# Altium project PCB_Project.PrjPCB (part 1 of 2)
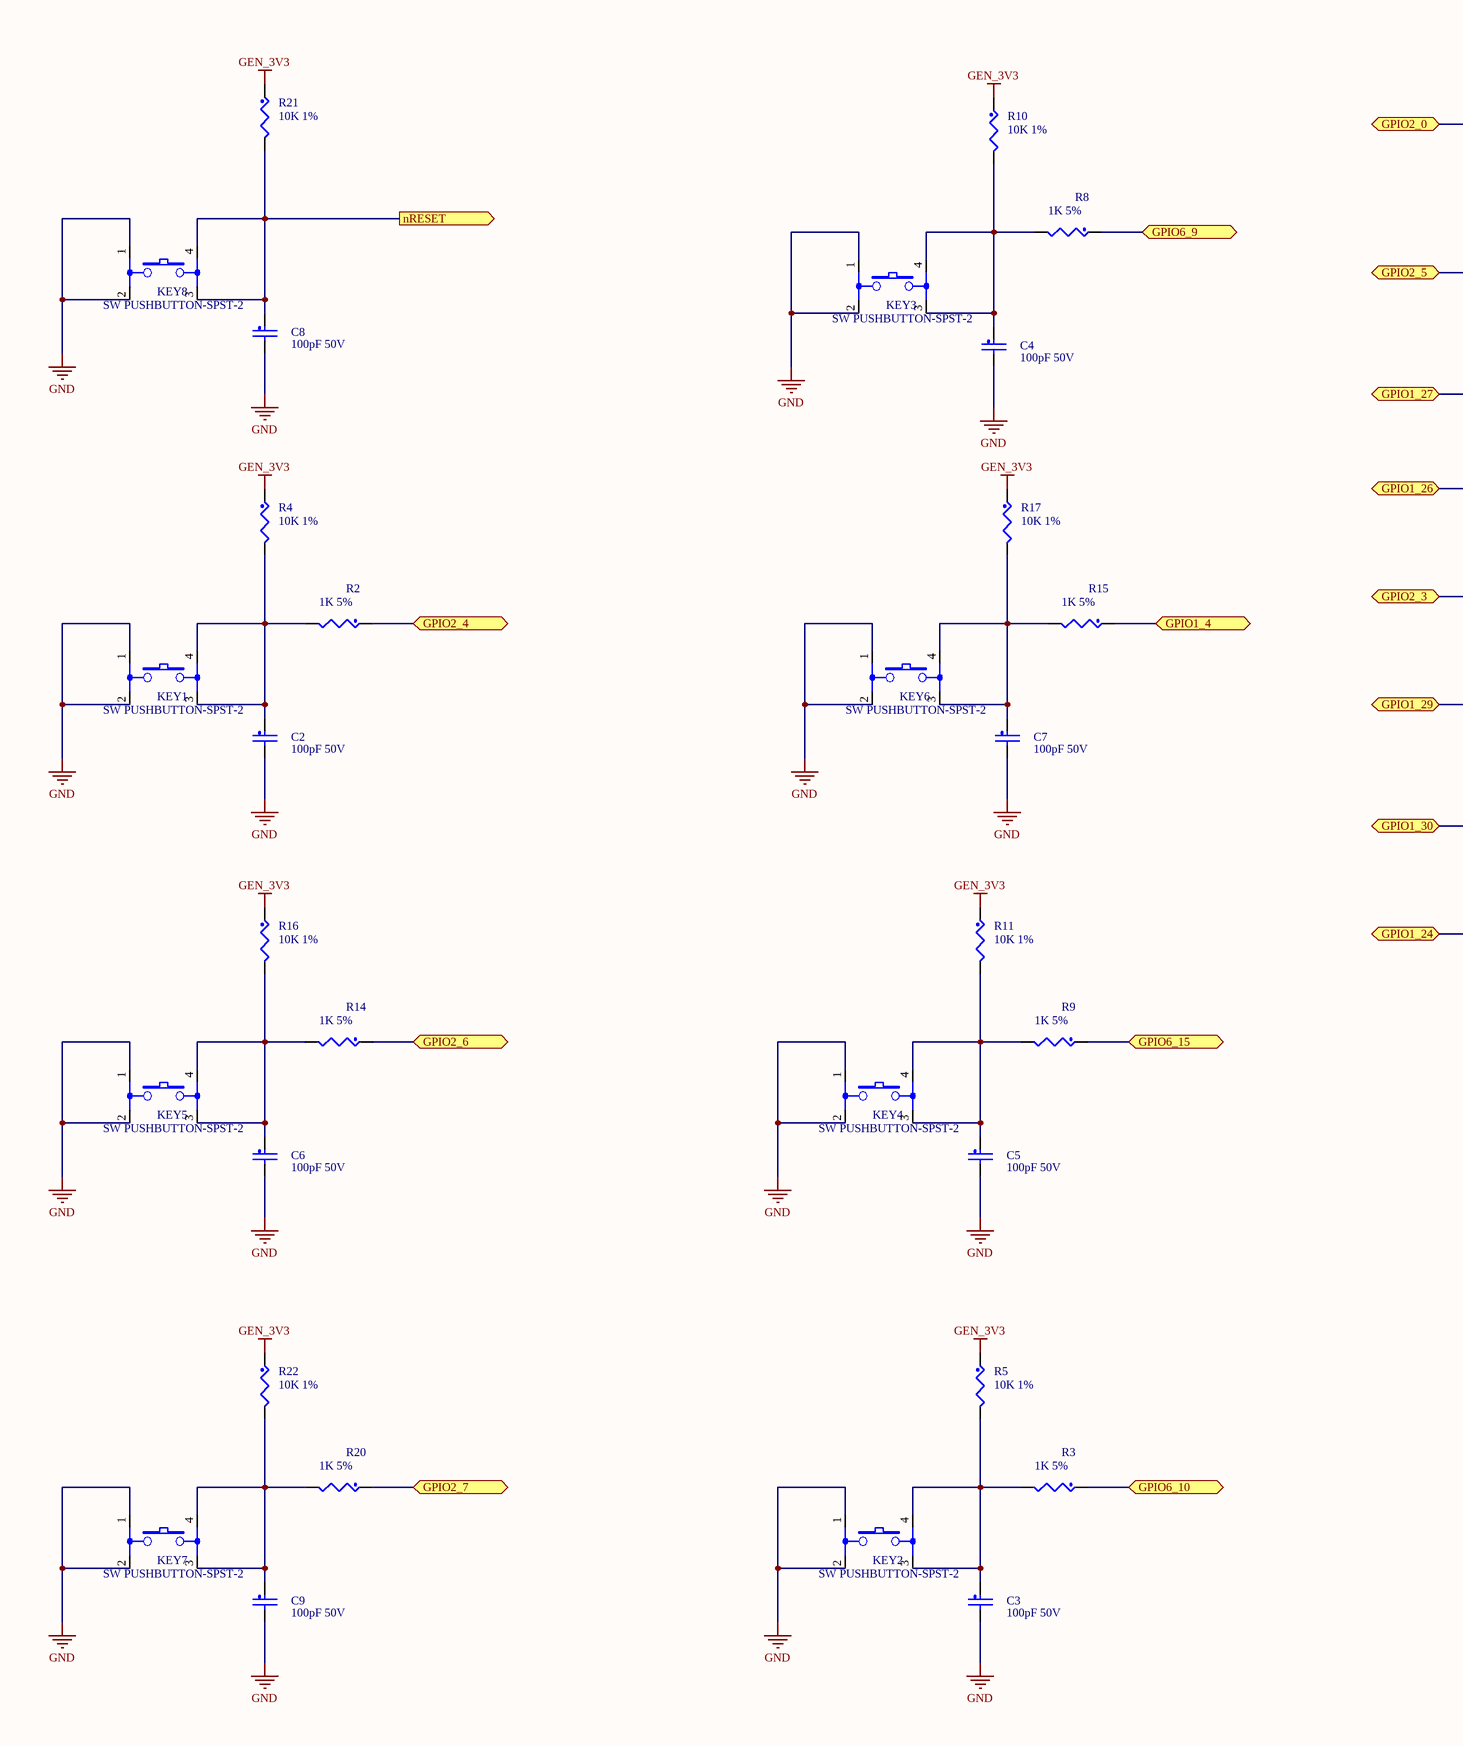
[diagram p0: Button.SchDoc, left]
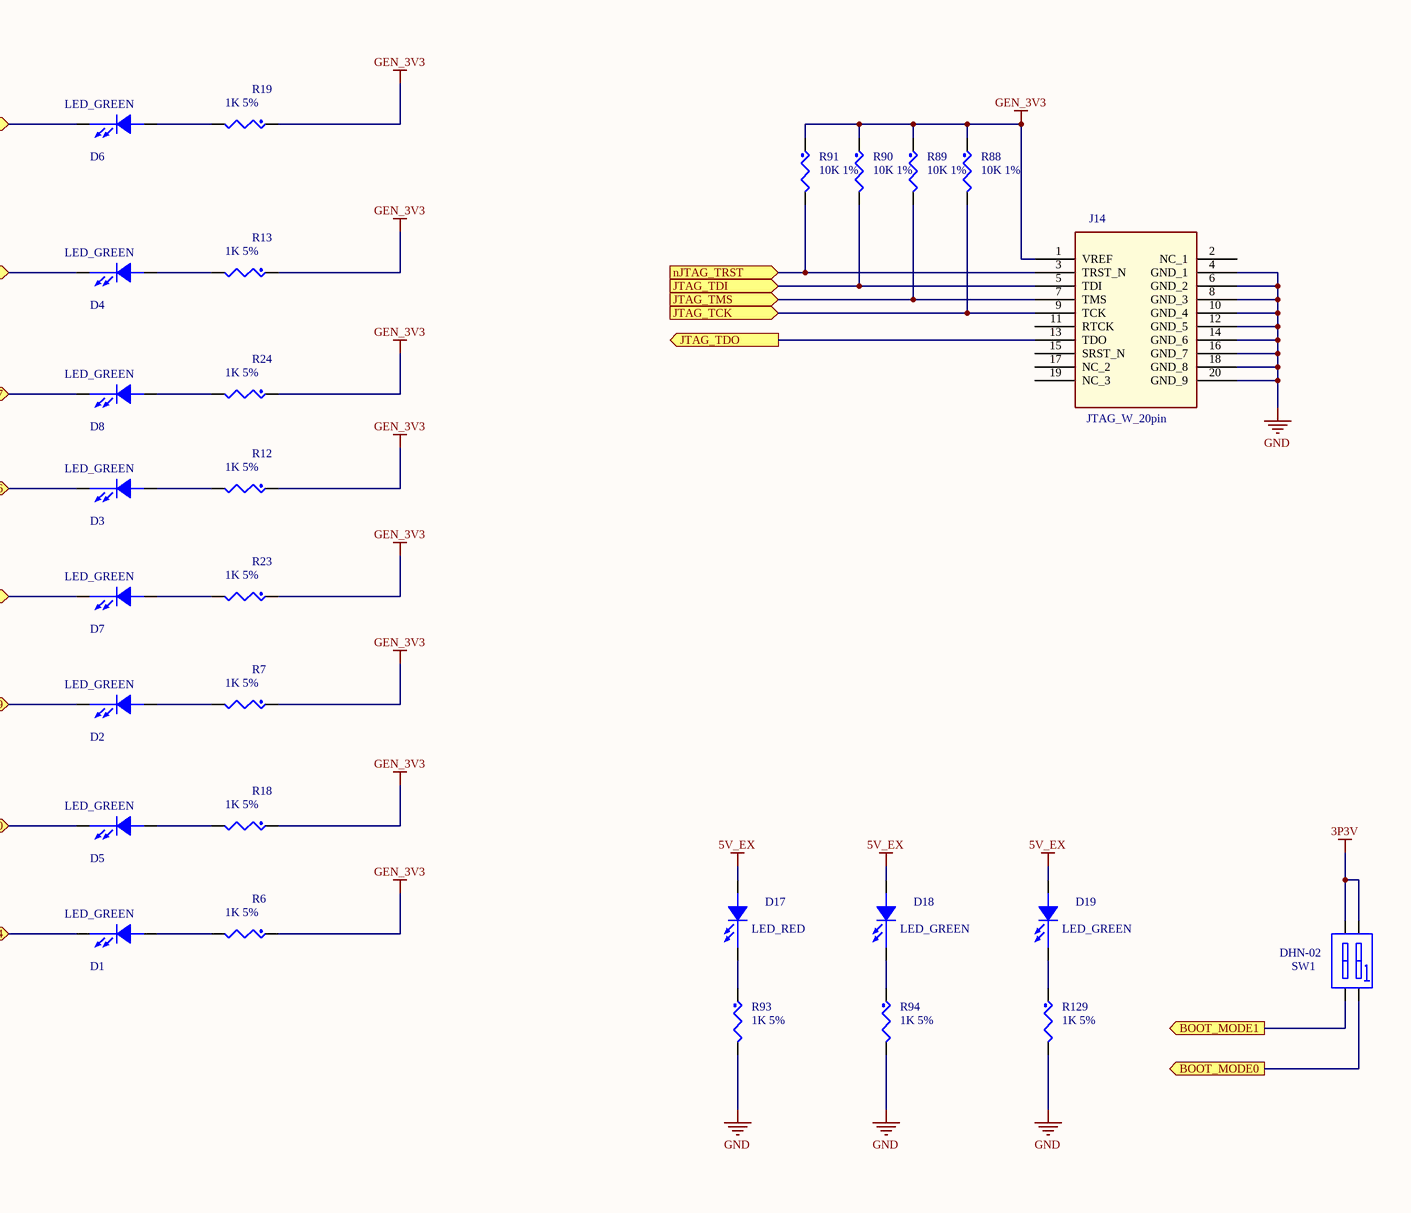
[diagram p1: Button.SchDoc, right]
10 sheets, 321 parts. Net scope: flat (ports and power ports of the same name join across sheets).
Board file: PCB1.PcbDoc
Sheets:
  Button.SchDoc
  Connector.SchDoc
  Ethernet.SchDoc
  HDMI.SchDoc
  I2C.SchDoc
  Key-RTC.SchDoc
  LVDS.SchDoc
  PWR_IN.SchDoc
  UART.SchDoc
  USB.SchDoc

## Sheet Button.SchDoc
size D

### Parts
C2  100pF 50V  [SC0603]
C3  100pF 50V  [SC0603]
C4  100pF 50V  [SC0603]
C5  100pF 50V  [SC0603]
C6  100pF 50V  [SC0603]
C7  100pF 50V  [SC0603]
C8  100pF 50V  [SC0603]
C9  100pF 50V  [SC0603]
D1  LED_GREEN  [SD0603]
D2  LED_GREEN  [SD0603]
D3  LED_GREEN  [SD0603]
D4  LED_GREEN  [SD0603]
D5  LED_GREEN  [SD0603]
D6  LED_GREEN  [SD0603]
D7  LED_GREEN  [SD0603]
D8  LED_GREEN  [SD0603]
D17  LED_RED  [SD0603]
D18  LED_GREEN  [SD0603]
D19  LED_GREEN  [SD0603]
J14  JTAG_W_20pin  [DIPMH-2-2P54X2P54-20-8-W]
KEY1  SW PUSHBUTTON-SPST-2  [SB4-6X6-5-1]
KEY2  SW PUSHBUTTON-SPST-2  [SB4-6X6-5-1]
KEY3  SW PUSHBUTTON-SPST-2  [SB4-6X6-5-1]
KEY4  SW PUSHBUTTON-SPST-2  [SB4-6X6-5-1]
KEY5  SW PUSHBUTTON-SPST-2  [SB4-6X6-5-1]
KEY6  SW PUSHBUTTON-SPST-2  [SB4-6X6-5-1]
KEY7  SW PUSHBUTTON-SPST-2  [SB4-6X6-5-1]
KEY8  SW PUSHBUTTON-SPST-2  [SB4-6X6-5-1]
R2  1K 5%  [SR0603]
R3  1K 5%  [SR0603]
R4  10K 1%  [SR0603]
R5  10K 1%  [SR0603]
R6  1K 5%  [SR0603]
R7  1K 5%  [SR0603]
R8  1K 5%  [SR0603]
R9  1K 5%  [SR0603]
R10  10K 1%  [SR0603]
R11  10K 1%  [SR0603]
R12  1K 5%  [SR0603]
R13  1K 5%  [SR0603]
R14  1K 5%  [SR0603]
R15  1K 5%  [SR0603]
R16  10K 1%  [SR0603]
R17  10K 1%  [SR0603]
R18  1K 5%  [SR0603]
R19  1K 5%  [SR0603]
R20  1K 5%  [SR0603]
R21  10K 1%  [SR0603]
R22  10K 1%  [SR0603]
R23  1K 5%  [SR0603]
R24  1K 5%  [SR0603]
R88  10K 1%  [SR0603]
R89  10K 1%  [SR0603]
R90  10K 1%  [SR0603]
R91  10K 1%  [SR0603]
R93  1K 5%  [SR0603]
R94  1K 5%  [SR0603]
R129  1K 5%  [SR0603]
SW1  DHN-02  [SW4-10X4-2-1]

### Ports
BOOT_MODE0 (out), BOOT_MODE1 (out), GPIO1_4 (bidir), GPIO1_24 (bidir), GPIO1_26 (bidir), GPIO1_27 (bidir), GPIO1_29 (bidir), GPIO1_30 (bidir), GPIO2_0 (bidir), GPIO2_3 (bidir), GPIO2_4 (bidir), GPIO2_5 (bidir), GPIO2_6 (bidir), GPIO2_7 (bidir), GPIO6_9 (bidir), GPIO6_10 (bidir), GPIO6_15 (bidir), JTAG_TCK (in), JTAG_TDI (in), JTAG_TDO (out), JTAG_TMS (in), nJTAG_TRST (in), nRESET (out)

### Nets
3P3V: SW1.1(A1) SW1.2(A2)
5V_EX: D17.1(ANODE) D18.1(ANODE) D19.1(ANODE)
GEN_3V3: J14.1(VREF) R4.1 R5.1 R6.1 R7.1 R10.1 R11.1 R12.1 R13.1 R16.1 R17.1 R18.1 R19.1 R21.1 R22.1 R23.1 R24.1 R88.1 R89.1 R90.1 R91.1
GND: C2.2 C3.2 C4.2 C5.2 C6.2 C7.2 C8.2 C9.2 J14.4(GND_1) J14.6(GND_2) J14.8(GND_3) J14.10(GND_4) J14.12(GND_5) J14.14(GND_6) J14.16(GND_7) J14.18(GND_8) J14.20(GND_9) KEY1.1 KEY1.2 KEY2.1 KEY2.2 KEY3.1 KEY3.2 KEY4.1 KEY4.2 KEY5.1 KEY5.2 KEY6.1 KEY6.2 KEY7.1 KEY7.2 KEY8.1 KEY8.2 R93.2 R94.2 R129.2
NetC2_1: C2.1 KEY1.3 KEY1.4 R2.2 R4.2
NetC3_1: C3.1 KEY2.3 KEY2.4 R3.2 R5.2
NetC4_1: C4.1 KEY3.3 KEY3.4 R8.2 R10.2
NetC5_1: C5.1 KEY4.3 KEY4.4 R9.2 R11.2
NetC6_1: C6.1 KEY5.3 KEY5.4 R14.2 R16.2
NetC7_1: C7.1 KEY6.3 KEY6.4 R15.2 R17.2
NetC8_1: C8.1 KEY8.3 KEY8.4 R21.2 ; port nRESET
NetC9_1: C9.1 KEY7.3 KEY7.4 R20.2 R22.2
NetD1_1: D1.1(ANODE) R6.2
NetD1_2: D1.2(CATHODE) ; port GPIO1_24
NetD2_1: D2.1(ANODE) R7.2
NetD2_2: D2.2(CATHODE) ; port GPIO1_29
NetD3_1: D3.1(ANODE) R12.2
NetD3_2: D3.2(CATHODE) ; port GPIO1_26
NetD4_1: D4.1(ANODE) R13.2
NetD4_2: D4.2(CATHODE) ; port GPIO2_5
NetD5_1: D5.1(ANODE) R18.2
NetD5_2: D5.2(CATHODE) ; port GPIO1_30
NetD6_1: D6.1(ANODE) R19.2
NetD6_2: D6.2(CATHODE) ; port GPIO2_0
NetD7_1: D7.1(ANODE) R23.2
NetD7_2: D7.2(CATHODE) ; port GPIO2_3
NetD8_1: D8.1(ANODE) R24.2
NetD8_2: D8.2(CATHODE) ; port GPIO1_27
NetD17_2: D17.2(CATHODE) R93.1
NetD18_2: D18.2(CATHODE) R94.1
NetD19_2: D19.2(CATHODE) R129.1
NetJ14_3: J14.3(TRST_N) R91.2 ; port nJTAG_TRST
NetJ14_5: J14.5(TDI) R90.2 ; port JTAG_TDI
NetJ14_7: J14.7(TMS) R89.2 ; port JTAG_TMS
NetJ14_9: J14.9(TCK) R88.2 ; port JTAG_TCK
NetJ14_13: J14.13(TDO) ; port JTAG_TDO
NetMXM314-92p2x9p6-0p5-socket_WH_P143: R15.1 ; port GPIO1_4
NetMXM314-92p2x9p6-0p5-socket_WH_S92: SW1.3(B2) ; port BOOT_MODE1
NetMXM314-92p2x9p6-0p5-socket_WH_S93: SW1.4(B1) ; port BOOT_MODE0
NetMXM314-92p2x9p6-0p5-socket_WH_S95: R2.1 ; port GPIO2_4
NetMXM314-92p2x9p6-0p5-socket_WH_S99: R8.1 ; port GPIO6_9
NetMXM314-92p2x9p6-0p5-socket_WH_S100: R14.1 ; port GPIO2_6
NetMXM314-92p2x9p6-0p5-socket_WH_S102: R20.1 ; port GPIO2_7
NetMXM314-92p2x9p6-0p5-socket_WH_S108: R3.1 ; port GPIO6_10
NetMXM314-92p2x9p6-0p5-socket_WH_S109: R9.1 ; port GPIO6_15

Not connected (* = marked no-connect by the designer): J14 2(NC_1) 11(RTCK) 15(SRST_N) 17(NC_2) 19(NC_3)

### Library data of the parts
C2-C9 = CAP_NP: CLASS: DISCRETE
D1-D8 D17-D19 = LED
J14 = JTAG_20pin
R2-R24 R88-R91 R93 R94 R129 = RES: CLASS: DISCRETE
SW1 = SW DIP-2_0

## Sheet Connector.SchDoc
size D
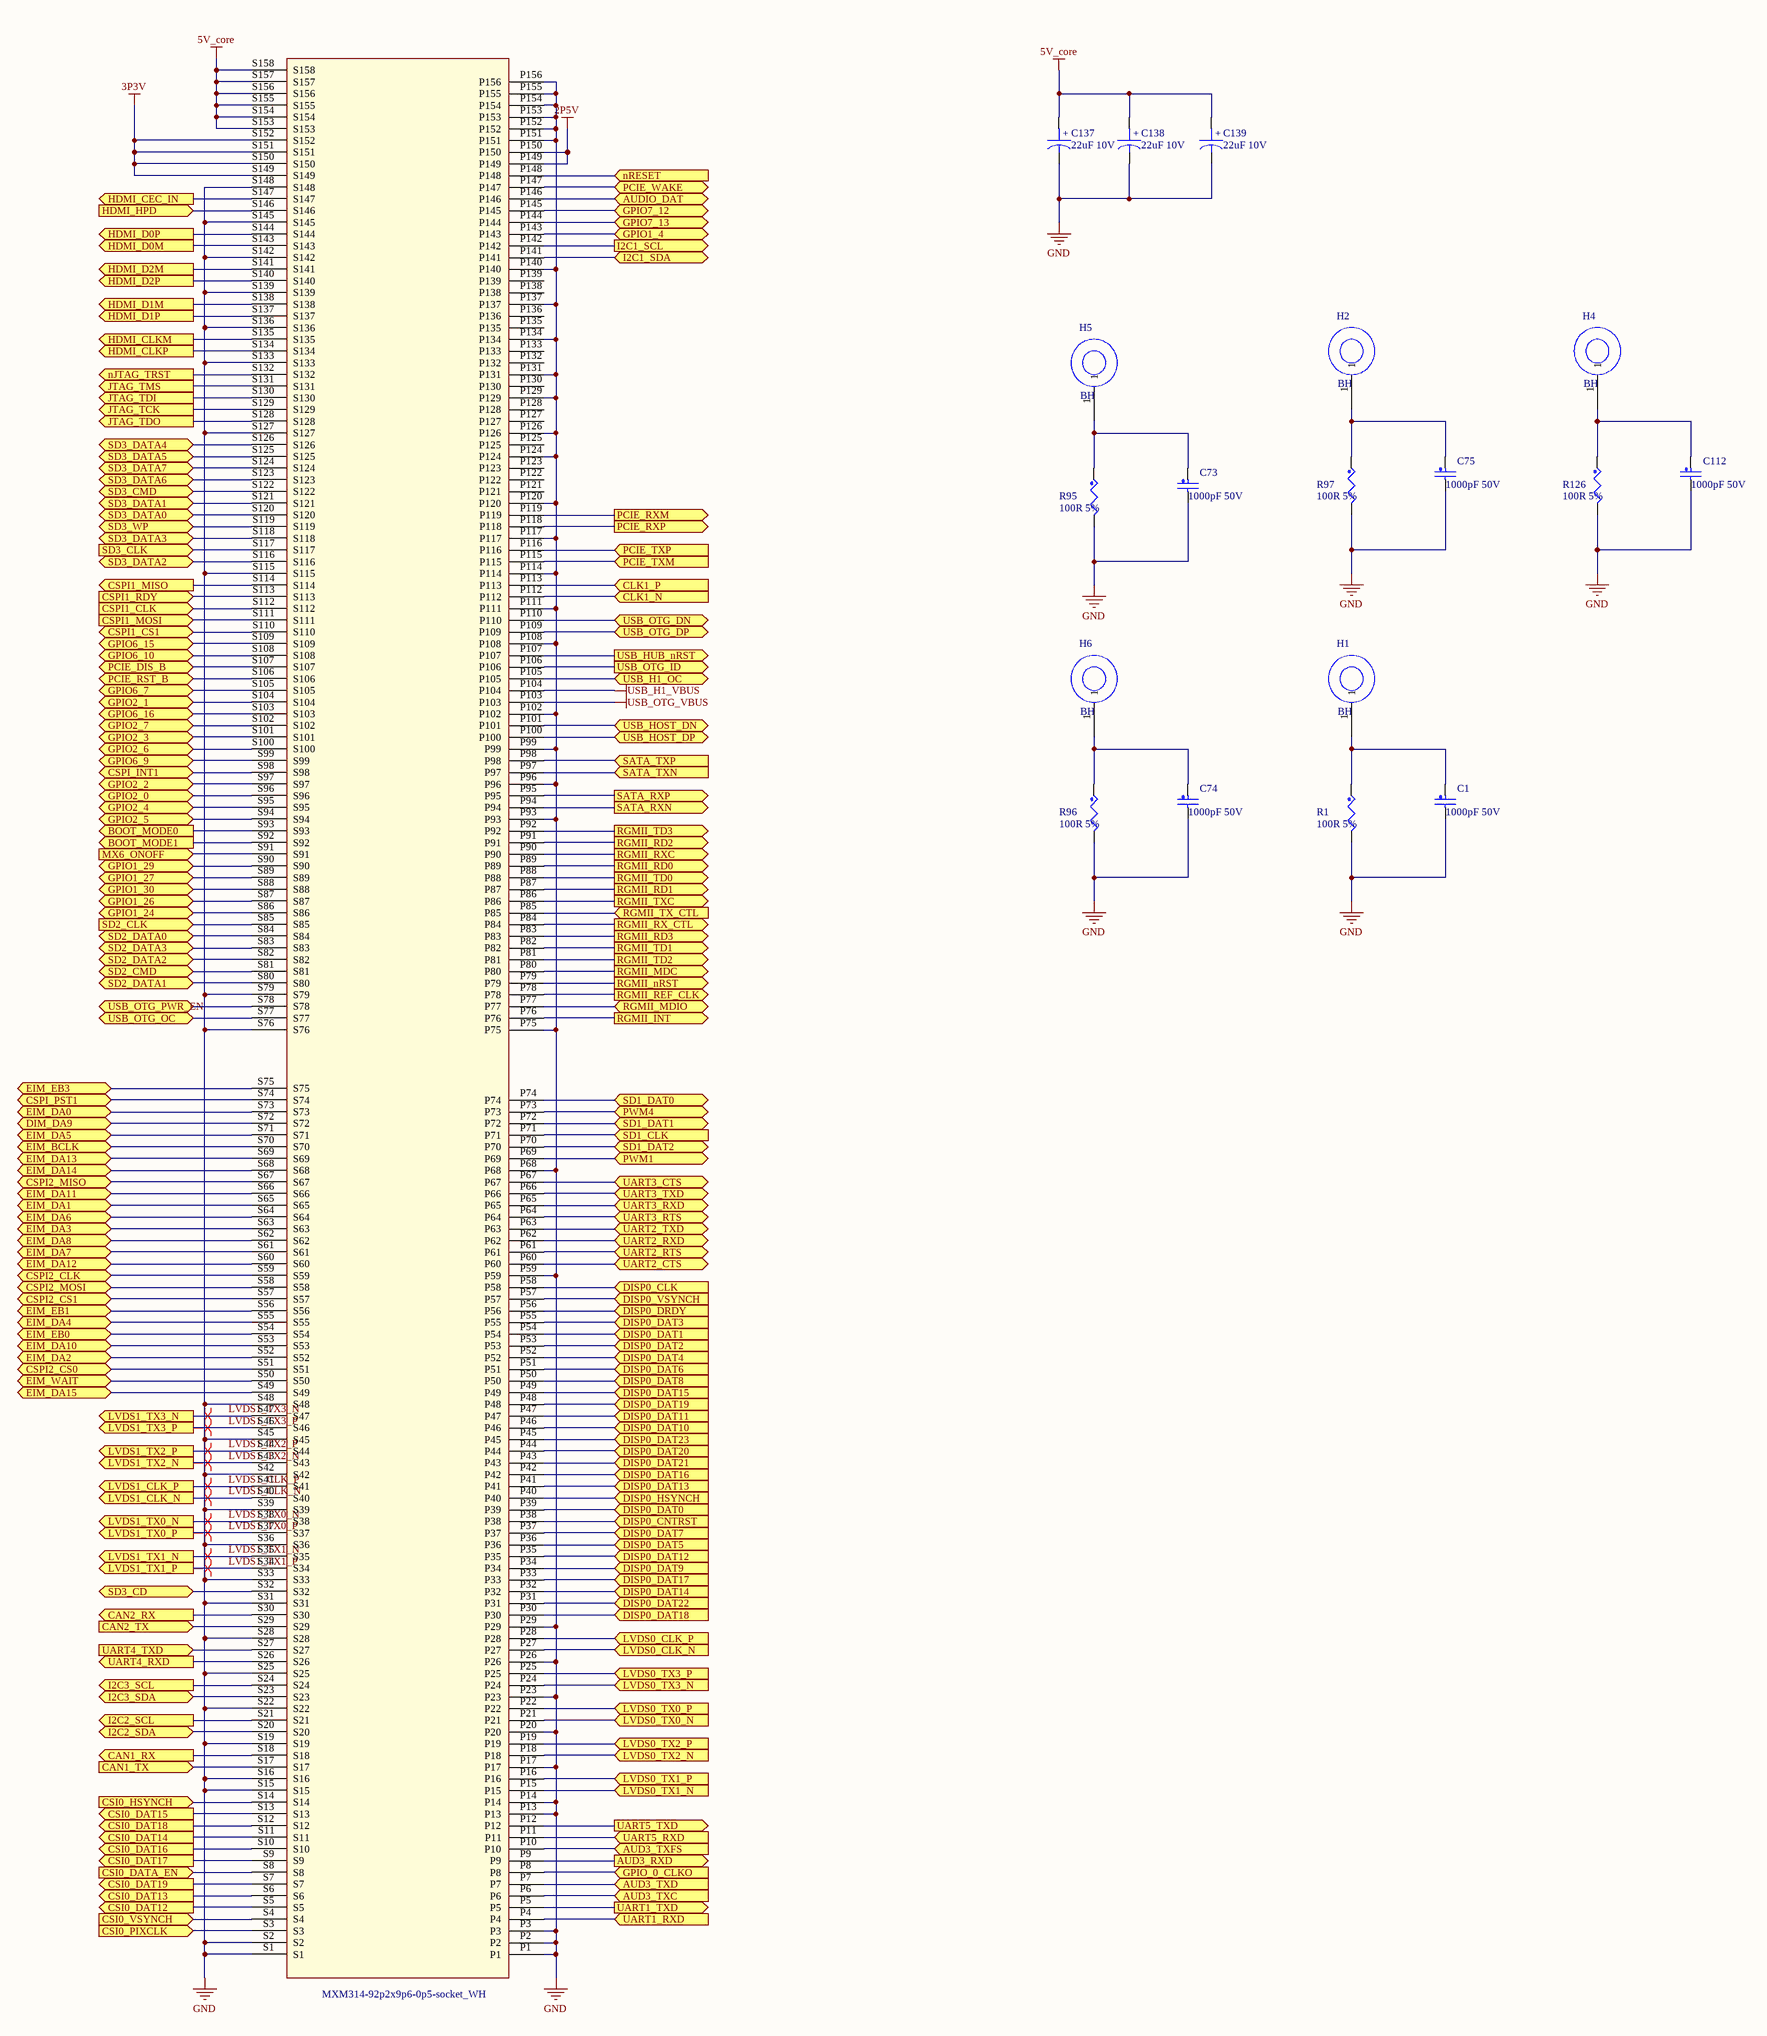
[diagram p2: Connector.SchDoc]

### Parts
C1  1000pF 50V  [SC0603]
C73  1000pF 50V  [SC0603]
C74  1000pF 50V  [SC0603]
C75  1000pF 50V  [SC0603]
C112  1000pF 50V  [SC0603]
C137  22uF 10V  [SC0805]
C138  22uF 10V  [SC0805]
C139  22uF 10V  [SC0805]
H1  BH  [H30]
H2  BH  [H30]
H4  BH  [H30]
H5  BH  [H30]
H6  BH  [H30]
MXM314-92p2x9p6-0p5-socket_WH  MXM314-92p2x9p6-0p5-socket_WH  [MXM314-92P2X9P6-0P5-SOCKET_WH]  (value not drawn)
R1  100R 5%  [SR0603]
R95  100R 5%  [SR0603]
R96  100R 5%  [SR0603]
R97  100R 5%  [SR0603]
R126  100R 5%  [SR0603]

### Ports
AUD3_RXD (out), AUD3_TXC (in), AUD3_TXD (in), AUD3_TXFS (in), AUDIO_DAT (bidir), BOOT_MODE0 (out), BOOT_MODE1 (out), CAN1_RX (out), CAN1_TX (in), CAN2_RX (out), CAN2_TX (in), CLK1_N (in), CLK1_P (in), CSI0_DAT12 (out), CSI0_DAT13 (out), CSI0_DAT14 (out), CSI0_DAT15 (out), CSI0_DAT16 (out), CSI0_DAT17 (out), CSI0_DAT18 (out), CSI0_DAT19 (out), CSI0_DATA_EN (in), CSI0_HSYNCH (in), CSI0_PIXCLK (in), CSI0_VSYNCH (in), CSPI1_CLK (in), CSPI1_CS1 (bidir), CSPI1_MISO (out), CSPI1_MOSI (in), CSPI1_RDY (in), CSPI2_CLK (bidir), CSPI2_CS0 (bidir), CSPI2_CS1 (bidir), CSPI2_MISO (bidir), CSPI2_MOSI (bidir), CSPI_INT1 (bidir), CSPI_PST1 (bidir), DIM_DA9 (bidir), DISP0_CLK (in), DISP0_CNTRST (in), DISP0_DAT0 (in), DISP0_DAT1 (in), DISP0_DAT2 (in), DISP0_DAT3 (in), DISP0_DAT4 (in), DISP0_DAT5 (in), DISP0_DAT6 (in), DISP0_DAT7 (in), DISP0_DAT8 (in), DISP0_DAT9 (in), DISP0_DAT10 (in), DISP0_DAT11 (in), DISP0_DAT12 (in), DISP0_DAT13 (in), DISP0_DAT14 (in), DISP0_DAT15 (in), DISP0_DAT16 (in), DISP0_DAT17 (in), DISP0_DAT18 (in), DISP0_DAT19 (in), DISP0_DAT20 (in), DISP0_DAT21 (in), DISP0_DAT22 (in), DISP0_DAT23 (in), DISP0_DRDY (in), DISP0_HSYNCH (in), DISP0_VSYNCH (in), EIM_BCLK (bidir), EIM_DA0 (bidir), EIM_DA1 (bidir), EIM_DA2 (bidir), EIM_DA3 (bidir), EIM_DA4 (bidir), EIM_DA5 (bidir), EIM_DA6 (bidir), EIM_DA7 (bidir), EIM_DA8 (bidir), EIM_DA10 (bidir), EIM_DA11 (bidir), EIM_DA12 (bidir), EIM_DA13 (bidir), EIM_DA14 (bidir), EIM_DA15 (bidir), EIM_EB0 (bidir), EIM_EB1 (bidir), EIM_EB3 (bidir), EIM_WAIT (bidir), GPIO1_4 (bidir), GPIO1_24 (bidir), GPIO1_26 (bidir), GPIO1_27 (bidir), GPIO1_29 (bidir), GPIO1_30 (bidir), GPIO2_0 (bidir), GPIO2_1 (bidir), GPIO2_2 (bidir), GPIO2_3 (bidir), GPIO2_4 (bidir), GPIO2_5 (bidir), GPIO2_6 (bidir), GPIO2_7 (bidir), GPIO6_7 (bidir), GPIO6_9 (bidir), GPIO6_10 (bidir), GPIO6_15 (bidir), GPIO6_16 (bidir), GPIO7_12 (bidir), GPIO7_13 (bidir), GPIO_0_CLKO (in), HDMI_CEC_IN (out), HDMI_CLKM (out), HDMI_CLKP (out), HDMI_D0M (out), HDMI_D0P (out), HDMI_D1M (out), HDMI_D1P (out), HDMI_D2M (out), HDMI_D2P (out), HDMI_HPD (in), I2C1_SCL (out), I2C1_SDA (bidir), I2C2_SCL (out), I2C2_SDA (bidir), I2C3_SCL (out), I2C3_SDA (bidir), JTAG_TCK (out), JTAG_TDI (out), JTAG_TDO (out), JTAG_TMS (out), LVDS0_CLK_N (in), LVDS0_CLK_P (in), LVDS0_TX0_N (in), LVDS0_TX0_P (in), LVDS0_TX1_N (in), LVDS0_TX1_P (in), LVDS0_TX2_N (in), LVDS0_TX2_P (in), LVDS0_TX3_N (in), LVDS0_TX3_P (in), LVDS1_CLK_N (out), LVDS1_CLK_P (out), LVDS1_TX0_N (out), LVDS1_TX0_P (out), LVDS1_TX1_N (out), LVDS1_TX1_P (out), LVDS1_TX2_N (out), LVDS1_TX2_P (out), LVDS1_TX3_N (out), LVDS1_TX3_P (out), MX6_ONOFF (in), nJTAG_TRST (out), nRESET (in), PCIE_DIS_B (bidir), PCIE_RST_B (bidir), PCIE_RXM (out), PCIE_RXP (out), PCIE_TXM (in), PCIE_TXP (in), PCIE_WAKE (bidir), PWM1 (bidir), PWM4 (bidir), RGMII_INT (out), RGMII_MDC (out), RGMII_MDIO (bidir), RGMII_nRST (out), RGMII_RD0 (out), RGMII_RD1 (out), RGMII_RD2 (out), RGMII_RD3 (out), RGMII_REF_CLK (out), RGMII_RX_CTL (out), RGMII_RXC (out), RGMII_TD0 (out), RGMII_TD1 (out), RGMII_TD2 (out), RGMII_TD3 (out), RGMII_TX_CTL (in), RGMII_TXC (out), SATA_RXN (out), SATA_RXP (out), SATA_TXN (in), SATA_TXP (in), SD1_CLK (in), SD1_DAT0 (bidir), SD1_DAT1 (bidir), SD1_DAT2 (bidir), SD2_CLK (in), SD2_CMD (bidir), SD2_DATA0 (bidir), SD2_DATA1 (bidir), SD2_DATA2 (bidir), SD2_DATA3 (bidir), SD3_CD (bidir), SD3_CLK (in), SD3_CMD (bidir), SD3_DATA0 (bidir), SD3_DATA1 (bidir), SD3_DATA2 (bidir), SD3_DATA3 (bidir), SD3_DATA4 (bidir), SD3_DATA5 (bidir), SD3_DATA6 (bidir), SD3_DATA7 (bidir), SD3_WP (bidir), UART1_RXD (in), UART1_TXD (out), UART2_CTS (bidir), UART2_RTS (bidir), UART2_RXD (bidir), UART2_TXD (bidir), UART3_CTS (bidir), UART3_RTS (bidir), UART3_RXD (bidir), UART3_TXD (bidir), UART4_RXD (out), UART4_TXD (in), UART5_RXD (in), UART5_TXD (out), USB_H1_OC (bidir), USB_HOST_DN (bidir), USB_HOST_DP (bidir), USB_HUB_nRST (out), USB_OTG_DN (bidir), USB_OTG_DP (bidir), USB_OTG_ID (out), USB_OTG_OC (bidir), USB_OTG_PWR_EN (bidir)

### Nets
2P5V: MXM314-92p2x9p6-0p5-socket_WH.P149 MXM314-92p2x9p6-0p5-socket_WH.P150
3P3V: MXM314-92p2x9p6-0p5-socket_WH.S149 MXM314-92p2x9p6-0p5-socket_WH.S150 MXM314-92p2x9p6-0p5-socket_WH.S151 MXM314-92p2x9p6-0p5-socket_WH.S152
5V_core: C137.1 C138.1 C139.1 MXM314-92p2x9p6-0p5-socket_WH.S153 MXM314-92p2x9p6-0p5-socket_WH.S154 MXM314-92p2x9p6-0p5-socket_WH.S155 MXM314-92p2x9p6-0p5-socket_WH.S156 MXM314-92p2x9p6-0p5-socket_WH.S157 MXM314-92p2x9p6-0p5-socket_WH.S158
GND: C1.2 C73.2 C74.2 C75.2 C112.2 C137.2 C138.2 C139.2 MXM314-92p2x9p6-0p5-socket_WH.P1 MXM314-92p2x9p6-0p5-socket_WH.P2 MXM314-92p2x9p6-0p5-socket_WH.P3 MXM314-92p2x9p6-0p5-socket_WH.P13 MXM314-92p2x9p6-0p5-socket_WH.P14 MXM314-92p2x9p6-0p5-socket_WH.P17 MXM314-92p2x9p6-0p5-socket_WH.P20 MXM314-92p2x9p6-0p5-socket_WH.P23 MXM314-92p2x9p6-0p5-socket_WH.P26 MXM314-92p2x9p6-0p5-socket_WH.P29 MXM314-92p2x9p6-0p5-socket_WH.P59 MXM314-92p2x9p6-0p5-socket_WH.P68 MXM314-92p2x9p6-0p5-socket_WH.P75 MXM314-92p2x9p6-0p5-socket_WH.P93 MXM314-92p2x9p6-0p5-socket_WH.P96 MXM314-92p2x9p6-0p5-socket_WH.P99 MXM314-92p2x9p6-0p5-socket_WH.P102 MXM314-92p2x9p6-0p5-socket_WH.P108 MXM314-92p2x9p6-0p5-socket_WH.P111 MXM314-92p2x9p6-0p5-socket_WH.P114 MXM314-92p2x9p6-0p5-socket_WH.P117 MXM314-92p2x9p6-0p5-socket_WH.P120 MXM314-92p2x9p6-0p5-socket_WH.P124 MXM314-92p2x9p6-0p5-socket_WH.P126 MXM314-92p2x9p6-0p5-socket_WH.P129 MXM314-92p2x9p6-0p5-socket_WH.P131 MXM314-92p2x9p6-0p5-socket_WH.P134 MXM314-92p2x9p6-0p5-socket_WH.P137 MXM314-92p2x9p6-0p5-socket_WH.P140 MXM314-92p2x9p6-0p5-socket_WH.P151 MXM314-92p2x9p6-0p5-socket_WH.P152 MXM314-92p2x9p6-0p5-socket_WH.P153 MXM314-92p2x9p6-0p5-socket_WH.P154 MXM314-92p2x9p6-0p5-socket_WH.P155 MXM314-92p2x9p6-0p5-socket_WH.P156 MXM314-92p2x9p6-0p5-socket_WH.S1 MXM314-92p2x9p6-0p5-socket_WH.S2 MXM314-92p2x9p6-0p5-socket_WH.S15 MXM314-92p2x9p6-0p5-socket_WH.S16 MXM314-92p2x9p6-0p5-socket_WH.S19 MXM314-92p2x9p6-0p5-socket_WH.S22 MXM314-92p2x9p6-0p5-socket_WH.S25 MXM314-92p2x9p6-0p5-socket_WH.S28 MXM314-92p2x9p6-0p5-socket_WH.S31 MXM314-92p2x9p6-0p5-socket_WH.S33 MXM314-92p2x9p6-0p5-socket_WH.S36 MXM314-92p2x9p6-0p5-socket_WH.S39 MXM314-92p2x9p6-0p5-socket_WH.S42 MXM314-92p2x9p6-0p5-socket_WH.S45 MXM314-92p2x9p6-0p5-socket_WH.S48 MXM314-92p2x9p6-0p5-socket_WH.S76 MXM314-92p2x9p6-0p5-socket_WH.S79 MXM314-92p2x9p6-0p5-socket_WH.S115 MXM314-92p2x9p6-0p5-socket_WH.S127 MXM314-92p2x9p6-0p5-socket_WH.S133 MXM314-92p2x9p6-0p5-socket_WH.S136 MXM314-92p2x9p6-0p5-socket_WH.S139 MXM314-92p2x9p6-0p5-socket_WH.S142 MXM314-92p2x9p6-0p5-socket_WH.S145 MXM314-92p2x9p6-0p5-socket_WH.S148 R1.2 R95.2 R96.2 R97.2 R126.2
USB_H1_VBUS: MXM314-92p2x9p6-0p5-socket_WH.P104
USB_OTG_VBUS: MXM314-92p2x9p6-0p5-socket_WH.P103
HDMI_CLK_N: MXM314-92p2x9p6-0p5-socket_WH.S135 ; port HDMI_CLKM
HDMI_CLK_P: MXM314-92p2x9p6-0p5-socket_WH.S134 ; port HDMI_CLKP
HDMI_D0_N: MXM314-92p2x9p6-0p5-socket_WH.S143 ; port HDMI_D0M
HDMI_D0_P: MXM314-92p2x9p6-0p5-socket_WH.S144 ; port HDMI_D0P
HDMI_D1_N: MXM314-92p2x9p6-0p5-socket_WH.S138 ; port HDMI_D1M
HDMI_D1_P: MXM314-92p2x9p6-0p5-socket_WH.S137 ; port HDMI_D1P
HDMI_D2_N: MXM314-92p2x9p6-0p5-socket_WH.S141 ; port HDMI_D2M
HDMI_D2_P: MXM314-92p2x9p6-0p5-socket_WH.S140 ; port HDMI_D2P
LVDS1_CLK_N: MXM314-92p2x9p6-0p5-socket_WH.S40 ; port LVDS1_CLK_N
LVDS1_CLK_P: MXM314-92p2x9p6-0p5-socket_WH.S41 ; port LVDS1_CLK_P
LVDS1_TX0_N: MXM314-92p2x9p6-0p5-socket_WH.S38 ; port LVDS1_TX0_N
LVDS1_TX0_P: MXM314-92p2x9p6-0p5-socket_WH.S37 ; port LVDS1_TX0_P
LVDS1_TX1_N: MXM314-92p2x9p6-0p5-socket_WH.S35 ; port LVDS1_TX1_N
LVDS1_TX1_P: MXM314-92p2x9p6-0p5-socket_WH.S34 ; port LVDS1_TX1_P
LVDS1_TX2_N: MXM314-92p2x9p6-0p5-socket_WH.S43 ; port LVDS1_TX2_N
LVDS1_TX2_P: MXM314-92p2x9p6-0p5-socket_WH.S44 ; port LVDS1_TX2_P
LVDS1_TX3_N: MXM314-92p2x9p6-0p5-socket_WH.S47 ; port LVDS1_TX3_N
LVDS1_TX3_P: MXM314-92p2x9p6-0p5-socket_WH.S46 ; port LVDS1_TX3_P
USB_HOST_D_N: MXM314-92p2x9p6-0p5-socket_WH.P101 ; port USB_HOST_DN
USB_HOST_D_P: MXM314-92p2x9p6-0p5-socket_WH.P100 ; port USB_HOST_DP
USB_OTG_D_N: MXM314-92p2x9p6-0p5-socket_WH.P110 ; port USB_OTG_DN
USB_OTG_D_P: MXM314-92p2x9p6-0p5-socket_WH.P109 ; port USB_OTG_DP
NetC1_1: C1.1 H1.1 R1.1
NetC8_1: MXM314-92p2x9p6-0p5-socket_WH.P148 ; port nRESET
NetC51_1: MXM314-92p2x9p6-0p5-socket_WH.P79 ; port RGMII_nRST
NetC68_1: MXM314-92p2x9p6-0p5-socket_WH.S146 ; port HDMI_HPD
NetC73_1: C73.1 H5.1 R95.1
NetC74_1: C74.1 H6.1 R96.1
NetC75_1: C75.1 H2.1 R97.1
NetC87_1: MXM314-92p2x9p6-0p5-socket_WH.P144 ; port GPIO7_13
NetC112_1: C112.1 H4.1 R126.1
NetC132_2: MXM314-92p2x9p6-0p5-socket_WH.P107 ; port USB_HUB_nRST
NetD1_2: MXM314-92p2x9p6-0p5-socket_WH.S86 ; port GPIO1_24
NetD2_2: MXM314-92p2x9p6-0p5-socket_WH.S90 ; port GPIO1_29
NetD3_2: MXM314-92p2x9p6-0p5-socket_WH.S87 ; port GPIO1_26
NetD4_2: MXM314-92p2x9p6-0p5-socket_WH.S94 ; port GPIO2_5
NetD5_2: MXM314-92p2x9p6-0p5-socket_WH.S88 ; port GPIO1_30
NetD6_2: MXM314-92p2x9p6-0p5-socket_WH.S96 ; port GPIO2_0
NetD7_2: MXM314-92p2x9p6-0p5-socket_WH.S101 ; port GPIO2_3
NetD8_2: MXM314-92p2x9p6-0p5-socket_WH.S89 ; port GPIO1_27
NetJ11_16: MXM314-92p2x9p6-0p5-socket_WH.S104 ; port GPIO2_1
NetJ11_17: MXM314-92p2x9p6-0p5-socket_WH.S105 ; port GPIO6_7
NetJ11_19: MXM314-92p2x9p6-0p5-socket_WH.P69 ; port PWM1
NetJ12_4: MXM314-92p2x9p6-0p5-socket_WH.P106 ; port USB_OTG_ID
NetJ14_3: MXM314-92p2x9p6-0p5-socket_WH.S132 ; port nJTAG_TRST
NetJ14_5: MXM314-92p2x9p6-0p5-socket_WH.S130 ; port JTAG_TDI
NetJ14_7: MXM314-92p2x9p6-0p5-socket_WH.S131 ; port JTAG_TMS
NetJ14_9: MXM314-92p2x9p6-0p5-socket_WH.S129 ; port JTAG_TCK
NetJ14_13: MXM314-92p2x9p6-0p5-socket_WH.S128 ; port JTAG_TDO
NetMXM314-92p2x9p6-0p5-socket_WH_P4: MXM314-92p2x9p6-0p5-socket_WH.P4 ; port UART1_RXD
NetMXM314-92p2x9p6-0p5-socket_WH_P5: MXM314-92p2x9p6-0p5-socket_WH.P5 ; port UART1_TXD
NetMXM314-92p2x9p6-0p5-socket_WH_P6: MXM314-92p2x9p6-0p5-socket_WH.P6 ; port AUD3_TXC
NetMXM314-92p2x9p6-0p5-socket_WH_P7: MXM314-92p2x9p6-0p5-socket_WH.P7 ; port AUD3_TXD
NetMXM314-92p2x9p6-0p5-socket_WH_P8: MXM314-92p2x9p6-0p5-socket_WH.P8 ; port GPIO_0_CLKO
NetMXM314-92p2x9p6-0p5-socket_WH_P9: MXM314-92p2x9p6-0p5-socket_WH.P9 ; port AUD3_RXD
NetMXM314-92p2x9p6-0p5-socket_WH_P10: MXM314-92p2x9p6-0p5-socket_WH.P10 ; port AUD3_TXFS
NetMXM314-92p2x9p6-0p5-socket_WH_P11: MXM314-92p2x9p6-0p5-socket_WH.P11 ; port UART5_RXD
NetMXM314-92p2x9p6-0p5-socket_WH_P12: MXM314-92p2x9p6-0p5-socket_WH.P12 ; port UART5_TXD
NetMXM314-92p2x9p6-0p5-socket_WH_P15: MXM314-92p2x9p6-0p5-socket_WH.P15 ; port LVDS0_TX1_N
NetMXM314-92p2x9p6-0p5-socket_WH_P16: MXM314-92p2x9p6-0p5-socket_WH.P16 ; port LVDS0_TX1_P
NetMXM314-92p2x9p6-0p5-socket_WH_P18: MXM314-92p2x9p6-0p5-socket_WH.P18 ; port LVDS0_TX2_N
NetMXM314-92p2x9p6-0p5-socket_WH_P19: MXM314-92p2x9p6-0p5-socket_WH.P19 ; port LVDS0_TX2_P
NetMXM314-92p2x9p6-0p5-socket_WH_P21: MXM314-92p2x9p6-0p5-socket_WH.P21 ; port LVDS0_TX0_N
NetMXM314-92p2x9p6-0p5-socket_WH_P22: MXM314-92p2x9p6-0p5-socket_WH.P22 ; port LVDS0_TX0_P
NetMXM314-92p2x9p6-0p5-socket_WH_P24: MXM314-92p2x9p6-0p5-socket_WH.P24 ; port LVDS0_TX3_N
NetMXM314-92p2x9p6-0p5-socket_WH_P25: MXM314-92p2x9p6-0p5-socket_WH.P25 ; port LVDS0_TX3_P
NetMXM314-92p2x9p6-0p5-socket_WH_P27: MXM314-92p2x9p6-0p5-socket_WH.P27 ; port LVDS0_CLK_N
NetMXM314-92p2x9p6-0p5-socket_WH_P28: MXM314-92p2x9p6-0p5-socket_WH.P28 ; port LVDS0_CLK_P
NetMXM314-92p2x9p6-0p5-socket_WH_P30: MXM314-92p2x9p6-0p5-socket_WH.P30 ; port DISP0_DAT18
NetMXM314-92p2x9p6-0p5-socket_WH_P31: MXM314-92p2x9p6-0p5-socket_WH.P31 ; port DISP0_DAT22
NetMXM314-92p2x9p6-0p5-socket_WH_P32: MXM314-92p2x9p6-0p5-socket_WH.P32 ; port DISP0_DAT14
NetMXM314-92p2x9p6-0p5-socket_WH_P33: MXM314-92p2x9p6-0p5-socket_WH.P33 ; port DISP0_DAT17
NetMXM314-92p2x9p6-0p5-socket_WH_P34: MXM314-92p2x9p6-0p5-socket_WH.P34 ; port DISP0_DAT9
NetMXM314-92p2x9p6-0p5-socket_WH_P35: MXM314-92p2x9p6-0p5-socket_WH.P35 ; port DISP0_DAT12
NetMXM314-92p2x9p6-0p5-socket_WH_P36: MXM314-92p2x9p6-0p5-socket_WH.P36 ; port DISP0_DAT5
NetMXM314-92p2x9p6-0p5-socket_WH_P37: MXM314-92p2x9p6-0p5-socket_WH.P37 ; port DISP0_DAT7
NetMXM314-92p2x9p6-0p5-socket_WH_P38: MXM314-92p2x9p6-0p5-socket_WH.P38 ; port DISP0_CNTRST
NetMXM314-92p2x9p6-0p5-socket_WH_P39: MXM314-92p2x9p6-0p5-socket_WH.P39 ; port DISP0_DAT0
NetMXM314-92p2x9p6-0p5-socket_WH_P40: MXM314-92p2x9p6-0p5-socket_WH.P40 ; port DISP0_HSYNCH
NetMXM314-92p2x9p6-0p5-socket_WH_P41: MXM314-92p2x9p6-0p5-socket_WH.P41 ; port DISP0_DAT13
NetMXM314-92p2x9p6-0p5-socket_WH_P42: MXM314-92p2x9p6-0p5-socket_WH.P42 ; port DISP0_DAT16
NetMXM314-92p2x9p6-0p5-socket_WH_P43: MXM314-92p2x9p6-0p5-socket_WH.P43 ; port DISP0_DAT21
NetMXM314-92p2x9p6-0p5-socket_WH_P44: MXM314-92p2x9p6-0p5-socket_WH.P44 ; port DISP0_DAT20
NetMXM314-92p2x9p6-0p5-socket_WH_P45: MXM314-92p2x9p6-0p5-socket_WH.P45 ; port DISP0_DAT23
NetMXM314-92p2x9p6-0p5-socket_WH_P46: MXM314-92p2x9p6-0p5-socket_WH.P46 ; port DISP0_DAT10
NetMXM314-92p2x9p6-0p5-socket_WH_P47: MXM314-92p2x9p6-0p5-socket_WH.P47 ; port DISP0_DAT11
NetMXM314-92p2x9p6-0p5-socket_WH_P48: MXM314-92p2x9p6-0p5-socket_WH.P48 ; port DISP0_DAT19
NetMXM314-92p2x9p6-0p5-socket_WH_P49: MXM314-92p2x9p6-0p5-socket_WH.P49 ; port DISP0_DAT15
NetMXM314-92p2x9p6-0p5-socket_WH_P50: MXM314-92p2x9p6-0p5-socket_WH.P50 ; port DISP0_DAT8
NetMXM314-92p2x9p6-0p5-socket_WH_P51: MXM314-92p2x9p6-0p5-socket_WH.P51 ; port DISP0_DAT6
NetMXM314-92p2x9p6-0p5-socket_WH_P52: MXM314-92p2x9p6-0p5-socket_WH.P52 ; port DISP0_DAT4
NetMXM314-92p2x9p6-0p5-socket_WH_P53: MXM314-92p2x9p6-0p5-socket_WH.P53 ; port DISP0_DAT2
NetMXM314-92p2x9p6-0p5-socket_WH_P54: MXM314-92p2x9p6-0p5-socket_WH.P54 ; port DISP0_DAT1
NetMXM314-92p2x9p6-0p5-socket_WH_P55: MXM314-92p2x9p6-0p5-socket_WH.P55 ; port DISP0_DAT3
NetMXM314-92p2x9p6-0p5-socket_WH_P56: MXM314-92p2x9p6-0p5-socket_WH.P56 ; port DISP0_DRDY
NetMXM314-92p2x9p6-0p5-socket_WH_P57: MXM314-92p2x9p6-0p5-socket_WH.P57 ; port DISP0_VSYNCH
NetMXM314-92p2x9p6-0p5-socket_WH_P58: MXM314-92p2x9p6-0p5-socket_WH.P58 ; port DISP0_CLK
NetMXM314-92p2x9p6-0p5-socket_WH_P60: MXM314-92p2x9p6-0p5-socket_WH.P60 ; port UART2_CTS
NetMXM314-92p2x9p6-0p5-socket_WH_P61: MXM314-92p2x9p6-0p5-socket_WH.P61 ; port UART2_RTS
NetMXM314-92p2x9p6-0p5-socket_WH_P62: MXM314-92p2x9p6-0p5-socket_WH.P62 ; port UART2_RXD
NetMXM314-92p2x9p6-0p5-socket_WH_P63: MXM314-92p2x9p6-0p5-socket_WH.P63 ; port UART2_TXD
NetMXM314-92p2x9p6-0p5-socket_WH_P64: MXM314-92p2x9p6-0p5-socket_WH.P64 ; port UART3_RTS
NetMXM314-92p2x9p6-0p5-socket_WH_P65: MXM314-92p2x9p6-0p5-socket_WH.P65 ; port UART3_RXD
NetMXM314-92p2x9p6-0p5-socket_WH_P66: MXM314-92p2x9p6-0p5-socket_WH.P66 ; port UART3_TXD
NetMXM314-92p2x9p6-0p5-socket_WH_P67: MXM314-92p2x9p6-0p5-socket_WH.P67 ; port UART3_CTS
NetMXM314-92p2x9p6-0p5-socket_WH_P70: MXM314-92p2x9p6-0p5-socket_WH.P70 ; port SD1_DAT2
NetMXM314-92p2x9p6-0p5-socket_WH_P71: MXM314-92p2x9p6-0p5-socket_WH.P71 ; port SD1_CLK
NetMXM314-92p2x9p6-0p5-socket_WH_P72: MXM314-92p2x9p6-0p5-socket_WH.P72 ; port SD1_DAT1
NetMXM314-92p2x9p6-0p5-socket_WH_P73: MXM314-92p2x9p6-0p5-socket_WH.P73 ; port PWM4
NetMXM314-92p2x9p6-0p5-socket_WH_P74: MXM314-92p2x9p6-0p5-socket_WH.P74 ; port SD1_DAT0
NetMXM314-92p2x9p6-0p5-socket_WH_P76: MXM314-92p2x9p6-0p5-socket_WH.P76 ; port RGMII_INT
NetMXM314-92p2x9p6-0p5-socket_WH_P77: MXM314-92p2x9p6-0p5-socket_WH.P77 ; port RGMII_MDIO
NetMXM314-92p2x9p6-0p5-socket_WH_P78: MXM314-92p2x9p6-0p5-socket_WH.P78 ; port RGMII_REF_CLK
NetMXM314-92p2x9p6-0p5-socket_WH_P80: MXM314-92p2x9p6-0p5-socket_WH.P80 ; port RGMII_MDC
NetMXM314-92p2x9p6-0p5-socket_WH_P81: MXM314-92p2x9p6-0p5-socket_WH.P81 ; port RGMII_TD2
NetMXM314-92p2x9p6-0p5-socket_WH_P82: MXM314-92p2x9p6-0p5-socket_WH.P82 ; port RGMII_TD1
NetMXM314-92p2x9p6-0p5-socket_WH_P83: MXM314-92p2x9p6-0p5-socket_WH.P83 ; port RGMII_RD3
NetMXM314-92p2x9p6-0p5-socket_WH_P84: MXM314-92p2x9p6-0p5-socket_WH.P84 ; port RGMII_RX_CTL
NetMXM314-92p2x9p6-0p5-socket_WH_P85: MXM314-92p2x9p6-0p5-socket_WH.P85 ; port RGMII_TX_CTL
NetMXM314-92p2x9p6-0p5-socket_WH_P86: MXM314-92p2x9p6-0p5-socket_WH.P86 ; port RGMII_TXC
NetMXM314-92p2x9p6-0p5-socket_WH_P87: MXM314-92p2x9p6-0p5-socket_WH.P87 ; port RGMII_RD1
NetMXM314-92p2x9p6-0p5-socket_WH_P88: MXM314-92p2x9p6-0p5-socket_WH.P88 ; port RGMII_TD0
NetMXM314-92p2x9p6-0p5-socket_WH_P89: MXM314-92p2x9p6-0p5-socket_WH.P89 ; port RGMII_RD0
NetMXM314-92p2x9p6-0p5-socket_WH_P90: MXM314-92p2x9p6-0p5-socket_WH.P90 ; port RGMII_RXC
NetMXM314-92p2x9p6-0p5-socket_WH_P91: MXM314-92p2x9p6-0p5-socket_WH.P91 ; port RGMII_RD2
NetMXM314-92p2x9p6-0p5-socket_WH_P92: MXM314-92p2x9p6-0p5-socket_WH.P92 ; port RGMII_TD3
NetMXM314-92p2x9p6-0p5-socket_WH_P94: MXM314-92p2x9p6-0p5-socket_WH.P94 ; port SATA_RXN
NetMXM314-92p2x9p6-0p5-socket_WH_P95: MXM314-92p2x9p6-0p5-socket_WH.P95 ; port SATA_RXP
NetMXM314-92p2x9p6-0p5-socket_WH_P97: MXM314-92p2x9p6-0p5-socket_WH.P97 ; port SATA_TXN
NetMXM314-92p2x9p6-0p5-socket_WH_P98: MXM314-92p2x9p6-0p5-socket_WH.P98 ; port SATA_TXP
NetMXM314-92p2x9p6-0p5-socket_WH_P105: MXM314-92p2x9p6-0p5-socket_WH.P105 ; port USB_H1_OC
NetMXM314-92p2x9p6-0p5-socket_WH_P112: MXM314-92p2x9p6-0p5-socket_WH.P112 ; port CLK1_N
NetMXM314-92p2x9p6-0p5-socket_WH_P113: MXM314-92p2x9p6-0p5-socket_WH.P113 ; port CLK1_P
NetMXM314-92p2x9p6-0p5-socket_WH_P115: MXM314-92p2x9p6-0p5-socket_WH.P115 ; port PCIE_TXM
NetMXM314-92p2x9p6-0p5-socket_WH_P116: MXM314-92p2x9p6-0p5-socket_WH.P116 ; port PCIE_TXP
NetMXM314-92p2x9p6-0p5-socket_WH_P118: MXM314-92p2x9p6-0p5-socket_WH.P118 ; port PCIE_RXP
NetMXM314-92p2x9p6-0p5-socket_WH_P119: MXM314-92p2x9p6-0p5-socket_WH.P119 ; port PCIE_RXM
NetMXM314-92p2x9p6-0p5-socket_WH_P141: MXM314-92p2x9p6-0p5-socket_WH.P141 ; port I2C1_SDA
NetMXM314-92p2x9p6-0p5-socket_WH_P142: MXM314-92p2x9p6-0p5-socket_WH.P142 ; port I2C1_SCL
NetMXM314-92p2x9p6-0p5-socket_WH_P143: MXM314-92p2x9p6-0p5-socket_WH.P143 ; port GPIO1_4
NetMXM314-92p2x9p6-0p5-socket_WH_P145: MXM314-92p2x9p6-0p5-socket_WH.P145 ; port GPIO7_12
NetMXM314-92p2x9p6-0p5-socket_WH_P146: MXM314-92p2x9p6-0p5-socket_WH.P146 ; port AUDIO_DAT
NetMXM314-92p2x9p6-0p5-socket_WH_P147: MXM314-92p2x9p6-0p5-socket_WH.P147 ; port PCIE_WAKE
NetMXM314-92p2x9p6-0p5-socket_WH_S3: MXM314-92p2x9p6-0p5-socket_WH.S3 ; port CSI0_PIXCLK
NetMXM314-92p2x9p6-0p5-socket_WH_S4: MXM314-92p2x9p6-0p5-socket_WH.S4 ; port CSI0_VSYNCH
NetMXM314-92p2x9p6-0p5-socket_WH_S5: MXM314-92p2x9p6-0p5-socket_WH.S5 ; port CSI0_DAT12
NetMXM314-92p2x9p6-0p5-socket_WH_S6: MXM314-92p2x9p6-0p5-socket_WH.S6 ; port CSI0_DAT13
NetMXM314-92p2x9p6-0p5-socket_WH_S7: MXM314-92p2x9p6-0p5-socket_WH.S7 ; port CSI0_DAT19
NetMXM314-92p2x9p6-0p5-socket_WH_S8: MXM314-92p2x9p6-0p5-socket_WH.S8 ; port CSI0_DATA_EN
NetMXM314-92p2x9p6-0p5-socket_WH_S9: MXM314-92p2x9p6-0p5-socket_WH.S9 ; port CSI0_DAT17
NetMXM314-92p2x9p6-0p5-socket_WH_S10: MXM314-92p2x9p6-0p5-socket_WH.S10 ; port CSI0_DAT16
NetMXM314-92p2x9p6-0p5-socket_WH_S11: MXM314-92p2x9p6-0p5-socket_WH.S11 ; port CSI0_DAT14
NetMXM314-92p2x9p6-0p5-socket_WH_S12: MXM314-92p2x9p6-0p5-socket_WH.S12 ; port CSI0_DAT18
NetMXM314-92p2x9p6-0p5-socket_WH_S13: MXM314-92p2x9p6-0p5-socket_WH.S13 ; port CSI0_DAT15
NetMXM314-92p2x9p6-0p5-socket_WH_S14: MXM314-92p2x9p6-0p5-socket_WH.S14 ; port CSI0_HSYNCH
NetMXM314-92p2x9p6-0p5-socket_WH_S17: MXM314-92p2x9p6-0p5-socket_WH.S17 ; port CAN1_TX
NetMXM314-92p2x9p6-0p5-socket_WH_S18: MXM314-92p2x9p6-0p5-socket_WH.S18 ; port CAN1_RX
NetMXM314-92p2x9p6-0p5-socket_WH_S20: MXM314-92p2x9p6-0p5-socket_WH.S20 ; port I2C2_SDA
NetMXM314-92p2x9p6-0p5-socket_WH_S21: MXM314-92p2x9p6-0p5-socket_WH.S21 ; port I2C2_SCL
NetMXM314-92p2x9p6-0p5-socket_WH_S23: MXM314-92p2x9p6-0p5-socket_WH.S23 ; port I2C3_SDA
NetMXM314-92p2x9p6-0p5-socket_WH_S24: MXM314-92p2x9p6-0p5-socket_WH.S24 ; port I2C3_SCL
NetMXM314-92p2x9p6-0p5-socket_WH_S26: MXM314-92p2x9p6-0p5-socket_WH.S26 ; port UART4_RXD
NetMXM314-92p2x9p6-0p5-socket_WH_S27: MXM314-92p2x9p6-0p5-socket_WH.S27 ; port UART4_TXD
NetMXM314-92p2x9p6-0p5-socket_WH_S29: MXM314-92p2x9p6-0p5-socket_WH.S29 ; port CAN2_TX
NetMXM314-92p2x9p6-0p5-socket_WH_S30: MXM314-92p2x9p6-0p5-socket_WH.S30 ; port CAN2_RX
NetMXM314-92p2x9p6-0p5-socket_WH_S32: MXM314-92p2x9p6-0p5-socket_WH.S32 ; port SD3_CD
NetMXM314-92p2x9p6-0p5-socket_WH_S49: MXM314-92p2x9p6-0p5-socket_WH.S49 ; port EIM_DA15
NetMXM314-92p2x9p6-0p5-socket_WH_S50: MXM314-92p2x9p6-0p5-socket_WH.S50 ; port EIM_WAIT
NetMXM314-92p2x9p6-0p5-socket_WH_S51: MXM314-92p2x9p6-0p5-socket_WH.S51 ; port CSPI2_CS0
NetMXM314-92p2x9p6-0p5-socket_WH_S52: MXM314-92p2x9p6-0p5-socket_WH.S52 ; port EIM_DA2
NetMXM314-92p2x9p6-0p5-socket_WH_S53: MXM314-92p2x9p6-0p5-socket_WH.S53 ; port EIM_DA10
NetMXM314-92p2x9p6-0p5-socket_WH_S54: MXM314-92p2x9p6-0p5-socket_WH.S54 ; port EIM_EB0
NetMXM314-92p2x9p6-0p5-socket_WH_S55: MXM314-92p2x9p6-0p5-socket_WH.S55 ; port EIM_DA4
NetMXM314-92p2x9p6-0p5-socket_WH_S56: MXM314-92p2x9p6-0p5-socket_WH.S56 ; port EIM_EB1
NetMXM314-92p2x9p6-0p5-socket_WH_S57: MXM314-92p2x9p6-0p5-socket_WH.S57 ; port CSPI2_CS1
NetMXM314-92p2x9p6-0p5-socket_WH_S58: MXM314-92p2x9p6-0p5-socket_WH.S58 ; port CSPI2_MOSI
NetMXM314-92p2x9p6-0p5-socket_WH_S59: MXM314-92p2x9p6-0p5-socket_WH.S59 ; port CSPI2_CLK
NetMXM314-92p2x9p6-0p5-socket_WH_S60: MXM314-92p2x9p6-0p5-socket_WH.S60 ; port EIM_DA12
NetMXM314-92p2x9p6-0p5-socket_WH_S61: MXM314-92p2x9p6-0p5-socket_WH.S61 ; port EIM_DA7
NetMXM314-92p2x9p6-0p5-socket_WH_S62: MXM314-92p2x9p6-0p5-socket_WH.S62 ; port EIM_DA8
NetMXM314-92p2x9p6-0p5-socket_WH_S63: MXM314-92p2x9p6-0p5-socket_WH.S63 ; port EIM_DA3
NetMXM314-92p2x9p6-0p5-socket_WH_S64: MXM314-92p2x9p6-0p5-socket_WH.S64 ; port EIM_DA6
NetMXM314-92p2x9p6-0p5-socket_WH_S65: MXM314-92p2x9p6-0p5-socket_WH.S65 ; port EIM_DA1
NetMXM314-92p2x9p6-0p5-socket_WH_S66: MXM314-92p2x9p6-0p5-socket_WH.S66 ; port EIM_DA11
NetMXM314-92p2x9p6-0p5-socket_WH_S67: MXM314-92p2x9p6-0p5-socket_WH.S67 ; port CSPI2_MISO
NetMXM314-92p2x9p6-0p5-socket_WH_S68: MXM314-92p2x9p6-0p5-socket_WH.S68 ; port EIM_DA14
NetMXM314-92p2x9p6-0p5-socket_WH_S69: MXM314-92p2x9p6-0p5-socket_WH.S69 ; port EIM_DA13
NetMXM314-92p2x9p6-0p5-socket_WH_S70: MXM314-92p2x9p6-0p5-socket_WH.S70 ; port EIM_BCLK
NetMXM314-92p2x9p6-0p5-socket_WH_S71: MXM314-92p2x9p6-0p5-socket_WH.S71 ; port EIM_DA5
NetMXM314-92p2x9p6-0p5-socket_WH_S72: MXM314-92p2x9p6-0p5-socket_WH.S72 ; port DIM_DA9
NetMXM314-92p2x9p6-0p5-socket_WH_S73: MXM314-92p2x9p6-0p5-socket_WH.S73 ; port EIM_DA0
NetMXM314-92p2x9p6-0p5-socket_WH_S74: MXM314-92p2x9p6-0p5-socket_WH.S74 ; port CSPI_PST1
NetMXM314-92p2x9p6-0p5-socket_WH_S75: MXM314-92p2x9p6-0p5-socket_WH.S75 ; port EIM_EB3
NetMXM314-92p2x9p6-0p5-socket_WH_S77: MXM314-92p2x9p6-0p5-socket_WH.S77 ; port USB_OTG_OC
NetMXM314-92p2x9p6-0p5-socket_WH_S78: MXM314-92p2x9p6-0p5-socket_WH.S78 ; port USB_OTG_PWR_EN
NetMXM314-92p2x9p6-0p5-socket_WH_S80: MXM314-92p2x9p6-0p5-socket_WH.S80 ; port SD2_DATA1
NetMXM314-92p2x9p6-0p5-socket_WH_S81: MXM314-92p2x9p6-0p5-socket_WH.S81 ; port SD2_CMD
NetMXM314-92p2x9p6-0p5-socket_WH_S82: MXM314-92p2x9p6-0p5-socket_WH.S82 ; port SD2_DATA2
NetMXM314-92p2x9p6-0p5-socket_WH_S83: MXM314-92p2x9p6-0p5-socket_WH.S83 ; port SD2_DATA3
NetMXM314-92p2x9p6-0p5-socket_WH_S84: MXM314-92p2x9p6-0p5-socket_WH.S84 ; port SD2_DATA0
NetMXM314-92p2x9p6-0p5-socket_WH_S85: MXM314-92p2x9p6-0p5-socket_WH.S85 ; port SD2_CLK
NetMXM314-92p2x9p6-0p5-socket_WH_S91: MXM314-92p2x9p6-0p5-socket_WH.S91 ; port MX6_ONOFF
NetMXM314-92p2x9p6-0p5-socket_WH_S92: MXM314-92p2x9p6-0p5-socket_WH.S92 ; port BOOT_MODE1
NetMXM314-92p2x9p6-0p5-socket_WH_S93: MXM314-92p2x9p6-0p5-socket_WH.S93 ; port BOOT_MODE0
NetMXM314-92p2x9p6-0p5-socket_WH_S95: MXM314-92p2x9p6-0p5-socket_WH.S95 ; port GPIO2_4
NetMXM314-92p2x9p6-0p5-socket_WH_S97: MXM314-92p2x9p6-0p5-socket_WH.S97 ; port GPIO2_2
NetMXM314-92p2x9p6-0p5-socket_WH_S98: MXM314-92p2x9p6-0p5-socket_WH.S98 ; port CSPI_INT1
NetMXM314-92p2x9p6-0p5-socket_WH_S99: MXM314-92p2x9p6-0p5-socket_WH.S99 ; port GPIO6_9
NetMXM314-92p2x9p6-0p5-socket_WH_S100: MXM314-92p2x9p6-0p5-socket_WH.S100 ; port GPIO2_6
NetMXM314-92p2x9p6-0p5-socket_WH_S102: MXM314-92p2x9p6-0p5-socket_WH.S102 ; port GPIO2_7
NetMXM314-92p2x9p6-0p5-socket_WH_S103: MXM314-92p2x9p6-0p5-socket_WH.S103 ; port GPIO6_16
NetMXM314-92p2x9p6-0p5-socket_WH_S106: MXM314-92p2x9p6-0p5-socket_WH.S106 ; port PCIE_RST_B
NetMXM314-92p2x9p6-0p5-socket_WH_S107: MXM314-92p2x9p6-0p5-socket_WH.S107 ; port PCIE_DIS_B
NetMXM314-92p2x9p6-0p5-socket_WH_S108: MXM314-92p2x9p6-0p5-socket_WH.S108 ; port GPIO6_10
NetMXM314-92p2x9p6-0p5-socket_WH_S109: MXM314-92p2x9p6-0p5-socket_WH.S109 ; port GPIO6_15
NetMXM314-92p2x9p6-0p5-socket_WH_S110: MXM314-92p2x9p6-0p5-socket_WH.S110 ; port CSPI1_CS1
NetMXM314-92p2x9p6-0p5-socket_WH_S111: MXM314-92p2x9p6-0p5-socket_WH.S111 ; port CSPI1_MOSI
NetMXM314-92p2x9p6-0p5-socket_WH_S112: MXM314-92p2x9p6-0p5-socket_WH.S112 ; port CSPI1_CLK
NetMXM314-92p2x9p6-0p5-socket_WH_S113: MXM314-92p2x9p6-0p5-socket_WH.S113 ; port CSPI1_RDY
NetMXM314-92p2x9p6-0p5-socket_WH_S114: MXM314-92p2x9p6-0p5-socket_WH.S114 ; port CSPI1_MISO
NetMXM314-92p2x9p6-0p5-socket_WH_S116: MXM314-92p2x9p6-0p5-socket_WH.S116 ; port SD3_DATA2
NetMXM314-92p2x9p6-0p5-socket_WH_S117: MXM314-92p2x9p6-0p5-socket_WH.S117 ; port SD3_CLK
NetMXM314-92p2x9p6-0p5-socket_WH_S118: MXM314-92p2x9p6-0p5-socket_WH.S118 ; port SD3_DATA3
NetMXM314-92p2x9p6-0p5-socket_WH_S119: MXM314-92p2x9p6-0p5-socket_WH.S119 ; port SD3_WP
NetMXM314-92p2x9p6-0p5-socket_WH_S120: MXM314-92p2x9p6-0p5-socket_WH.S120 ; port SD3_DATA0
NetMXM314-92p2x9p6-0p5-socket_WH_S121: MXM314-92p2x9p6-0p5-socket_WH.S121 ; port SD3_DATA1
NetMXM314-92p2x9p6-0p5-socket_WH_S122: MXM314-92p2x9p6-0p5-socket_WH.S122 ; port SD3_CMD
NetMXM314-92p2x9p6-0p5-socket_WH_S123: MXM314-92p2x9p6-0p5-socket_WH.S123 ; port SD3_DATA6
NetMXM314-92p2x9p6-0p5-socket_WH_S124: MXM314-92p2x9p6-0p5-socket_WH.S124 ; port SD3_DATA7
NetMXM314-92p2x9p6-0p5-socket_WH_S125: MXM314-92p2x9p6-0p5-socket_WH.S125 ; port SD3_DATA5
NetMXM314-92p2x9p6-0p5-socket_WH_S126: MXM314-92p2x9p6-0p5-socket_WH.S126 ; port SD3_DATA4
NetMXM314-92p2x9p6-0p5-socket_WH_S147: MXM314-92p2x9p6-0p5-socket_WH.S147 ; port HDMI_CEC_IN

Not connected (* = marked no-connect by the designer): MXM314-92p2x9p6-0p5-socket_WH P121 P122 P123 P125 P127 P128 P130 P132 P133 P135 P136 P138 P139

### Layout directives
differential pair: LVDS1_CLK_N, LVDS1_CLK_P, LVDS1_TX0_N, LVDS1_TX0_P, LVDS1_TX1_N, LVDS1_TX1_P, LVDS1_TX2_N, LVDS1_TX2_P, LVDS1_TX3_N, LVDS1_TX3_P

### Notes on the sheet
- (in symbol CAP POL) +

### Library data of the parts
C1 C73-C75 C112 = CAP_NP: CLASS: DISCRETE
C137-C139 = CAP POL
MXM314-92p2x9p6-0p5-socket_WH = MXM314
R1 R95-R97 R126 = RES: CLASS: DISCRETE

## Sheet Ethernet.SchDoc
size A2
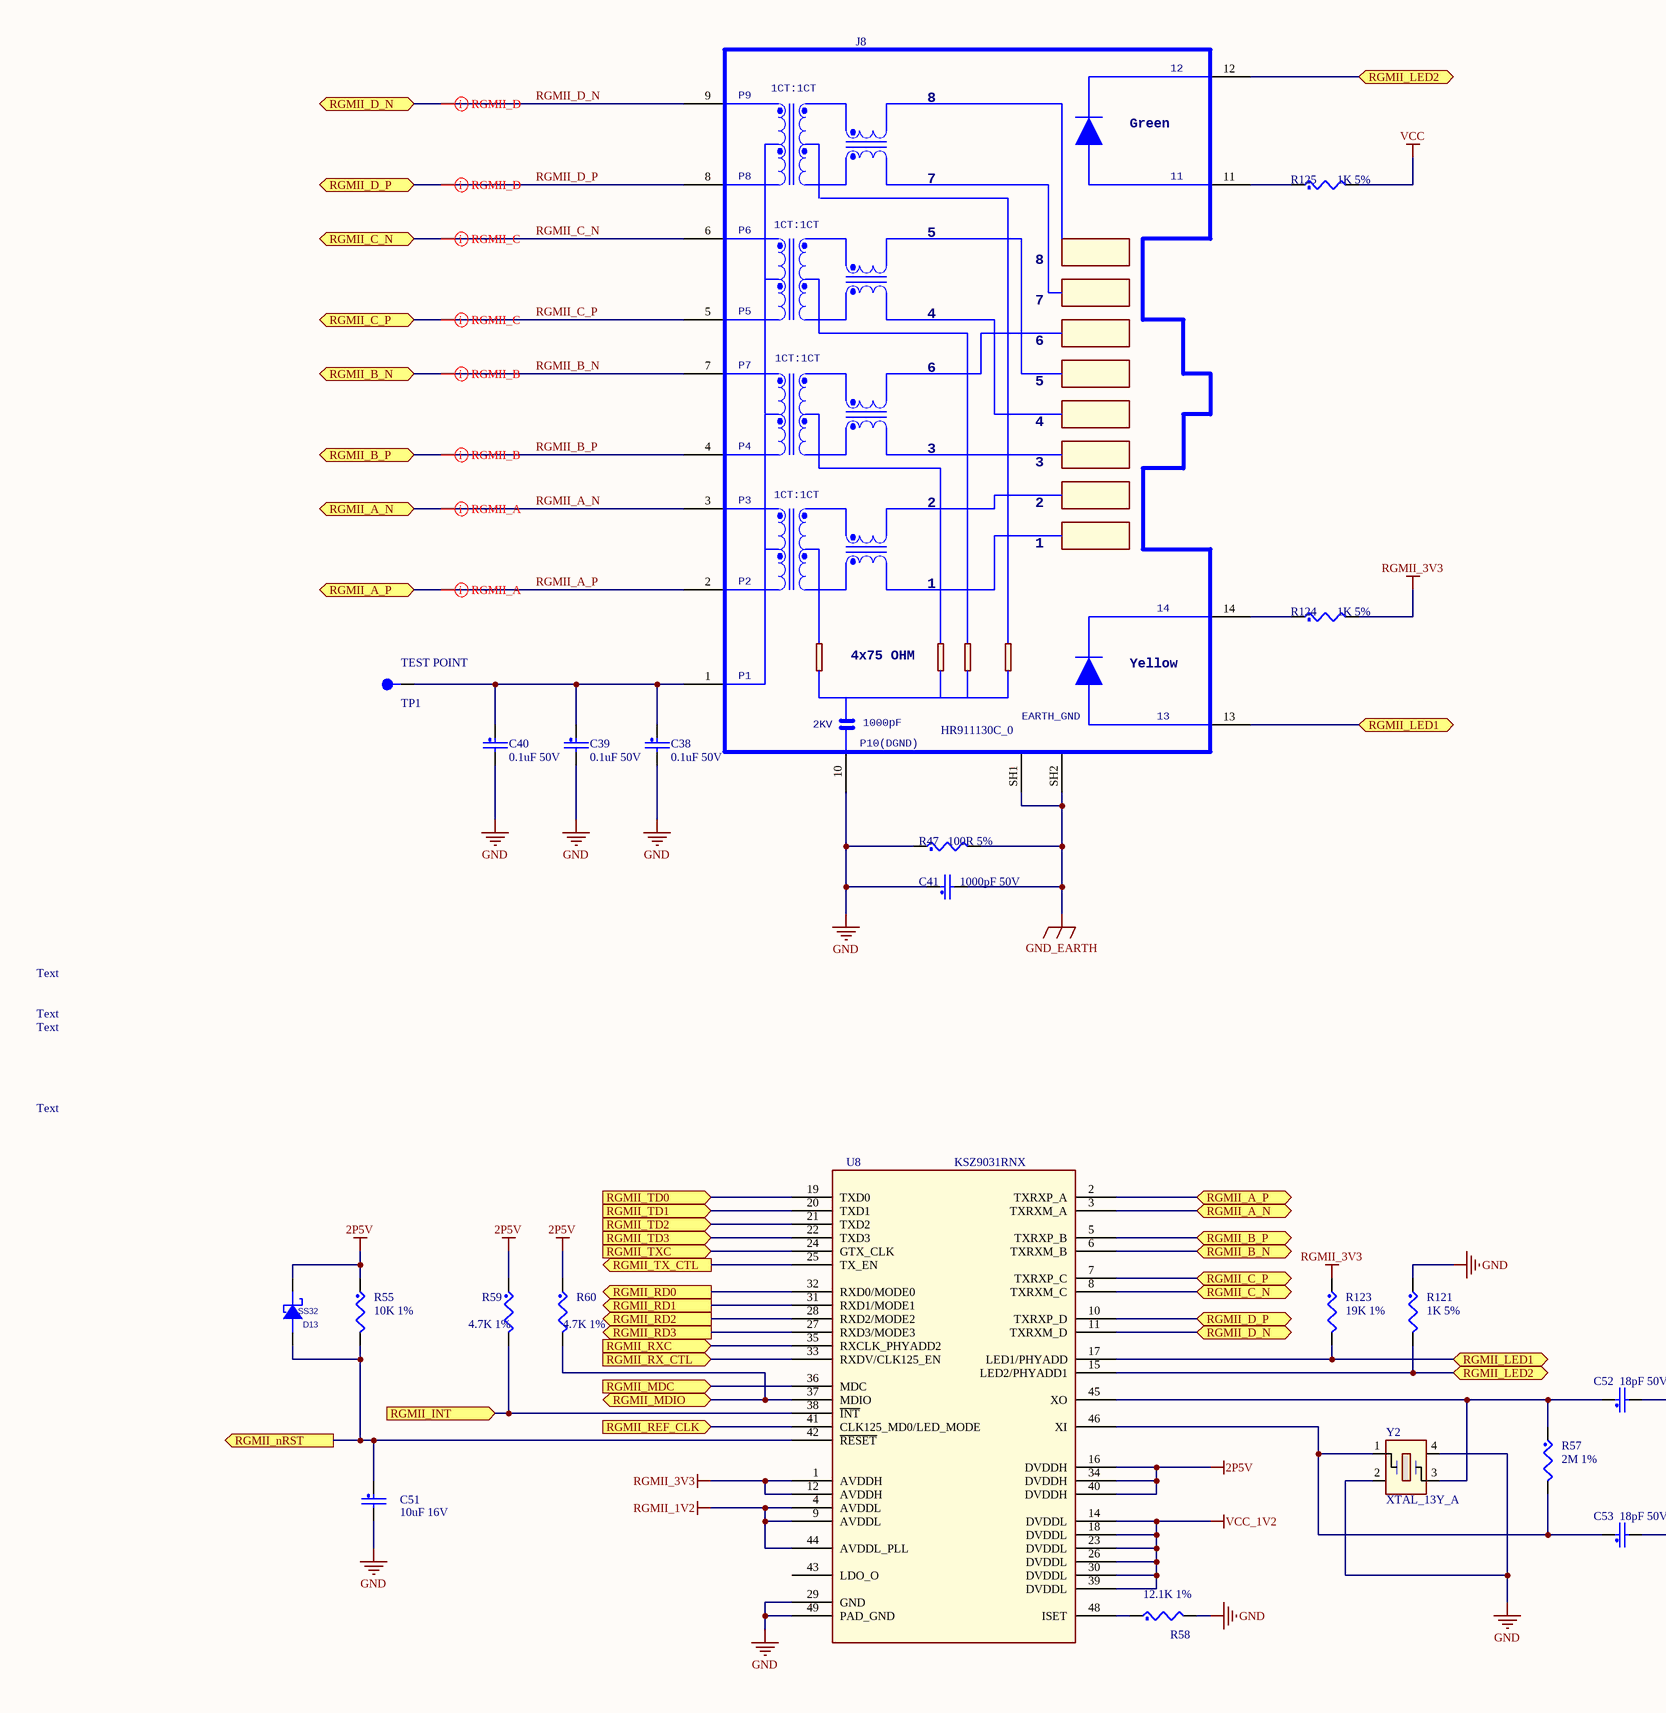
[diagram p3: Ethernet.SchDoc, left]
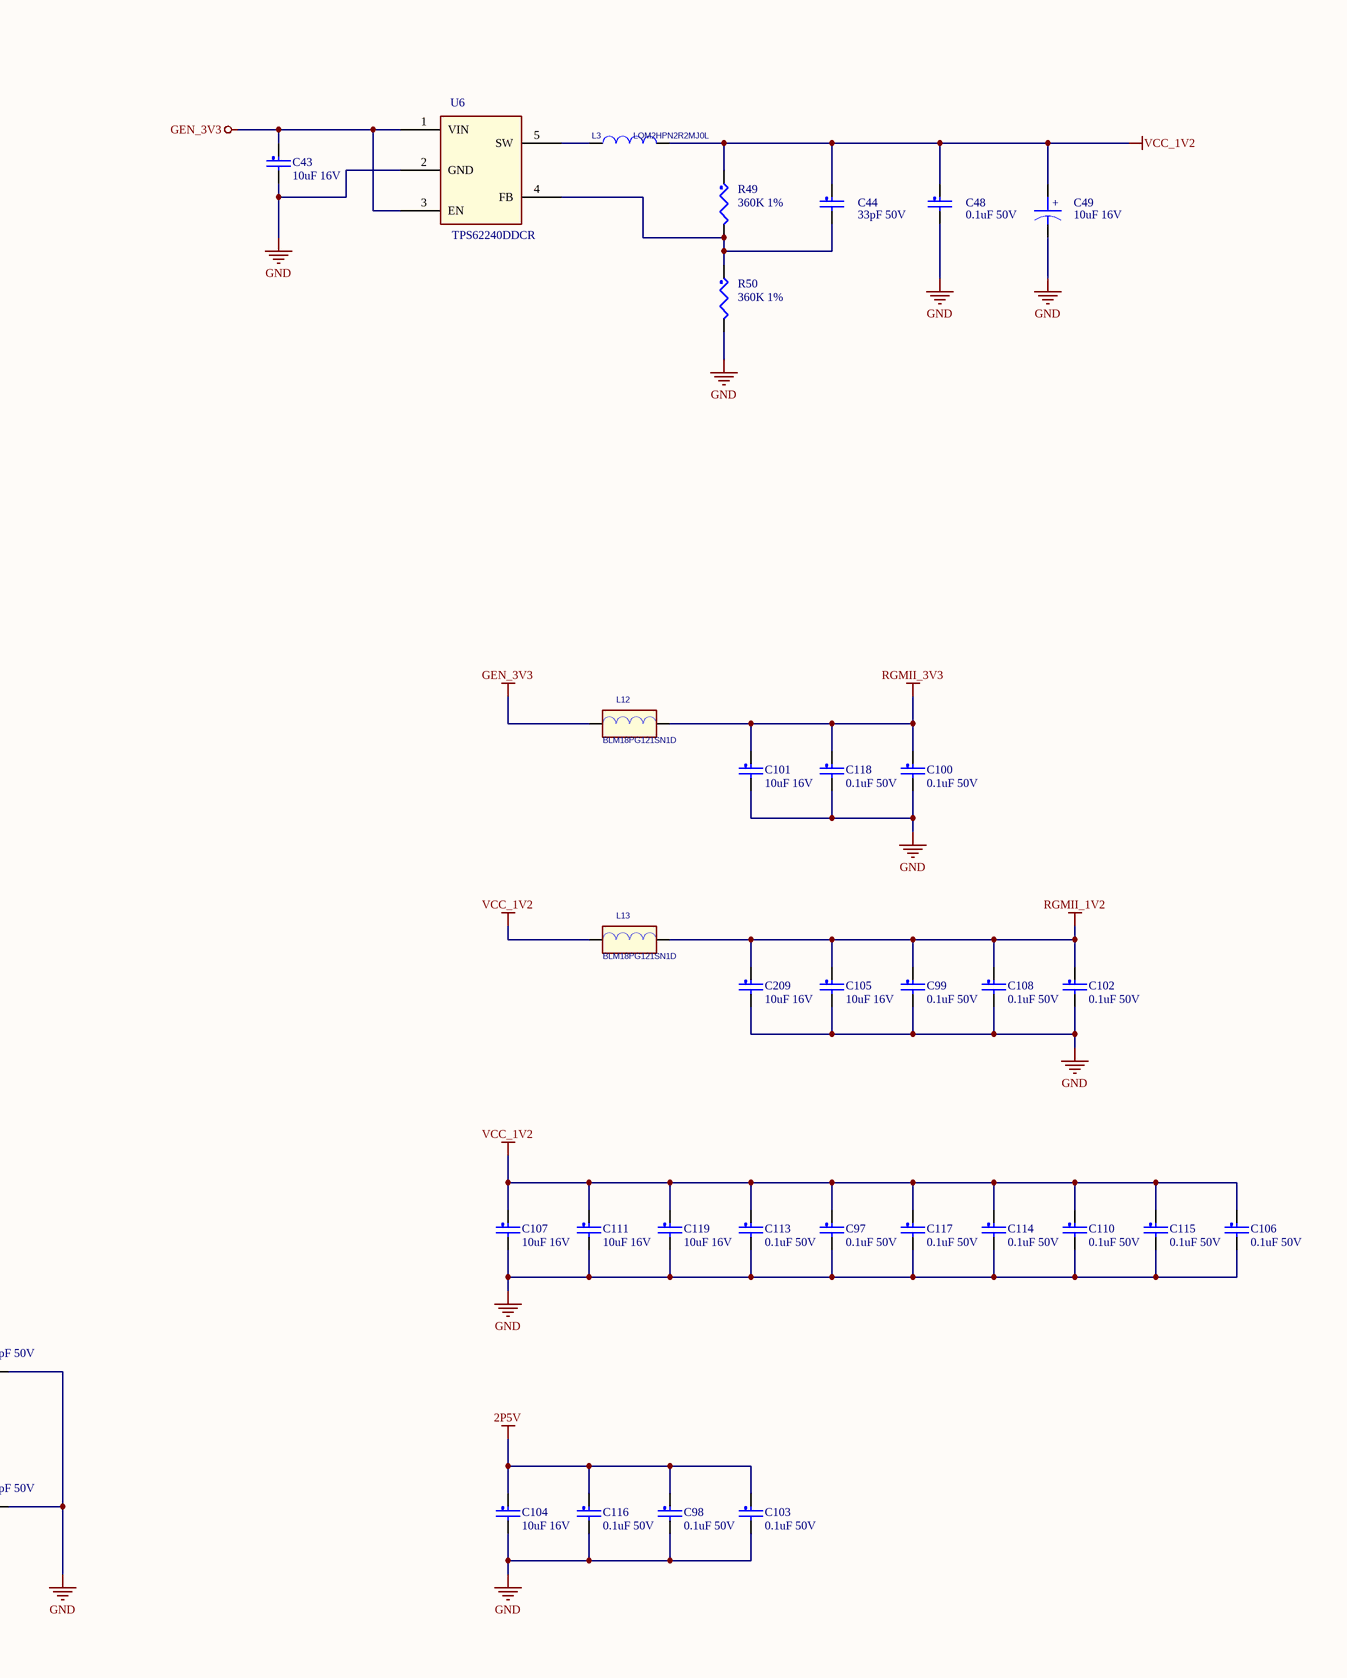
[diagram p4: Ethernet.SchDoc, right]

### Parts
C38  0.1uF 50V  [SC0603]
C39  0.1uF 50V  [SC0603]
C40  0.1uF 50V  [SC0603]
C41  1000pF 50V  [SC0603]
C43  10uF 16V  [SC0805]
C44  33pF 50V  [SC0603]
C48  0.1uF 50V  [SC0603]
C49  10uF 16V  [SC0805]
C51  10uF 16V  [SC0805]
C52  18pF 50V  [SC0603]
C53  18pF 50V  [SC0603]
C97  0.1uF 50V  [SC0603]
C98  0.1uF 50V  [SC0603]
C99  0.1uF 50V  [SC0603]
C100  0.1uF 50V  [SC0603]
C101  10uF 16V  [SC0805]
C102  0.1uF 50V  [SC0603]
C103  0.1uF 50V  [SC0603]
C104  10uF 16V  [SC0805]
C105  10uF 16V  [SC0805]
C106  0.1uF 50V  [SC0603]
C107  10uF 16V  [SC0805]
C108  0.1uF 50V  [SC0603]
C110  0.1uF 50V  [SC0603]
C111  10uF 16V  [SC0805]
C113  0.1uF 50V  [SC0805]
C114  0.1uF 50V  [SC0603]
C115  0.1uF 50V  [SC0603]
C116  0.1uF 50V  [SC0603]
C117  0.1uF 50V  [SC0603]
C118  0.1uF 50V  [SC0603]
C119  10uF 16V  [SC0805]
C209  10uF 16V  [SC0805]
D13  SS32  [DO-214AA]
J8  HR911130C_0  [RJ45-HANRUN-fixed]
L3  LQM2HPN2R2MJ0L  [SPM2P5X2]
L12  BLM18PG121SN1D  [SFB0603]
L13  BLM18PG121SN1D  [SFB0603]
R47  100R 5%  [SR0603]
R49  360K 1%  [SR0603]
R50  360K 1%  [SR0603]
R55  10K 1%  [SR0603]
R57  2M 1%  [SR0603]
R58  12.1K 1%  [SR0603]
R59  4.7K 1%  [SR0603]
R60  4.7K 1%  [SR0603]
R121  1K 5%  [SR0603]
R123  19K 1%  [SR0603]
R124  1K 5%  [SR0603]
R125  1K 5%  [SR0603]
TP1  TEST POINT  [TP_C]
U6  TPS62240DDCR  [SOT23-5]
U8  KSZ9031RNX  [QFN48-0P5-7X7]
Y2  XTAL_13Y_A  [SCRY4-3P2X2P5]

### Ports
RGMII_A_N (bidir), RGMII_A_P (bidir), RGMII_B_N (bidir), RGMII_B_P (bidir), RGMII_C_N (bidir), RGMII_C_P (bidir), RGMII_D_N (bidir), RGMII_D_P (bidir), RGMII_INT (in), RGMII_LED1 (bidir), RGMII_LED2 (bidir), RGMII_MDC (in), RGMII_MDIO (bidir), RGMII_nRST (out), RGMII_RD0 (out), RGMII_RD1 (out), RGMII_RD2 (out), RGMII_RD3 (out), RGMII_REF_CLK (in), RGMII_RX_CTL (in), RGMII_RXC (in), RGMII_TD0 (in), RGMII_TD1 (in), RGMII_TD2 (in), RGMII_TD3 (in), RGMII_TX_CTL (out), RGMII_TXC (in)

### Nets
2P5V: C98.1 C103.1 C104.1 C116.1 D13.2(CATHODE) R55.1 R59.1 R60.1 U8.16(DVDDH) U8.34(DVDDH) U8.40(DVDDH)
GEN_3V3: C43.1 L12.1 U6.1(VIN) U6.3(EN)
GND: C38.2 C39.2 C40.2 C41.1 C43.2 C48.2 C49.2 C51.2 C52.2 C53.2 C97.2 C98.2 C99.2 C100.2 C101.2 C102.2 C103.2 C104.2 C105.2 C106.2 C107.2 C108.2 C110.2 C111.2 C113.2 C114.2 C115.2 C116.2 C117.2 C118.2 C119.2 C209.2 J8.10(GND) R47.1 R50.2 R58.2 R121.1 U6.2(GND) U8.29(GND) U8.49(PAD_GND) Y2.2 Y2.4
GND_EARTH: C41.2 J8.SH1 J8.SH2 R47.2
NC: U8.13(NC) U8.47(NC)
RGMII_1V2: C99.1 C102.1 C105.1 C108.1 C209.1 L13.2 U8.4(AVDDL) U8.9(AVDDL) U8.44(AVDDL_PLL)
RGMII_3V3: C100.1 C101.1 C118.1 L12.2 R123.1 R124.2 U8.1(AVDDH) U8.12(AVDDH)
VCC: R125.2
VCC_1V2: C44.1 C48.1 C49.1 C97.1 C106.1 C107.1 C110.1 C111.1 C113.1 C114.1 C115.1 C117.1 C119.1 L3.2 L13.1 R49.1 U8.14(DVDDL) U8.18(DVDDL) U8.23(DVDDL) U8.26(DVDDL) U8.30(DVDDL) U8.39(DVDDL)
RGMII_A_N: J8.3(MDI_0-) U8.3(TXRXM_A) ; port RGMII_A_N
RGMII_A_P: J8.2(MDI_0+) U8.2(TXRXP_A) ; port RGMII_A_P
RGMII_B_N: J8.7(MDI_1-) U8.6(TXRXM_B) ; port RGMII_B_N
RGMII_B_P: J8.4(MDI_1+) U8.5(TXRXP_B) ; port RGMII_B_P
RGMII_C_N: J8.6(MDI_2-) U8.8(TXRXM_C) ; port RGMII_C_N
RGMII_C_P: J8.5(MDI_2+) U8.7(TXRXP_C) ; port RGMII_C_P
RGMII_D_N: J8.9(MDI_3-) U8.11(TXRXM_D) ; port RGMII_D_N
RGMII_D_P: J8.8(MDI_3+) U8.10(TXRXP_D) ; port RGMII_D_P
NetC38_1: C38.1 C39.1 C40.1 J8.1(CT1/2/3/4) TP1.1
NetC44_2: C44.2 R49.2 R50.1 U6.4(FB)
NetC51_1: C51.1 D13.1(ANODE) R55.2 U8.42(~{RESET}) ; port RGMII_nRST
NetC52_1: C52.1 R57.1 U8.45(XO) Y2.3
NetC53_1: C53.1 R57.2 U8.46(XI) Y2.1
NetJ8_11: J8.11(G_LED+) R125.1
NetJ8_12: J8.12(G_LED-) R121.2 U8.15(LED2/PHYADD1) ; port RGMII_LED2
NetJ8_13: J8.13(Y_LED-) R123.2 U8.17(LED1/PHYADD) ; port RGMII_LED1
NetJ8_14: J8.14(Y_LED+) R124.1
NetL3_1: L3.1 U6.5(SW)
NetMXM314-92p2x9p6-0p5-socket_WH_P76: R59.2 U8.38(~{INT}) ; port RGMII_INT
NetMXM314-92p2x9p6-0p5-socket_WH_P77: R60.2 U8.37(MDIO) ; port RGMII_MDIO
NetMXM314-92p2x9p6-0p5-socket_WH_P78: U8.41(CLK125_MD0/LED_MODE) ; port RGMII_REF_CLK
NetMXM314-92p2x9p6-0p5-socket_WH_P80: U8.36(MDC) ; port RGMII_MDC
NetMXM314-92p2x9p6-0p5-socket_WH_P81: U8.21(TXD2) ; port RGMII_TD2
NetMXM314-92p2x9p6-0p5-socket_WH_P82: U8.20(TXD1) ; port RGMII_TD1
NetMXM314-92p2x9p6-0p5-socket_WH_P83: U8.27(RXD3/MODE3) ; port RGMII_RD3
NetMXM314-92p2x9p6-0p5-socket_WH_P84: U8.33(RXDV/CLK125_EN) ; port RGMII_RX_CTL
NetMXM314-92p2x9p6-0p5-socket_WH_P85: U8.25(TX_EN) ; port RGMII_TX_CTL
NetMXM314-92p2x9p6-0p5-socket_WH_P86: U8.24(GTX_CLK) ; port RGMII_TXC
NetMXM314-92p2x9p6-0p5-socket_WH_P87: U8.31(RXD1/MODE1) ; port RGMII_RD1
NetMXM314-92p2x9p6-0p5-socket_WH_P88: U8.19(TXD0) ; port RGMII_TD0
NetMXM314-92p2x9p6-0p5-socket_WH_P89: U8.32(RXD0/MODE0) ; port RGMII_RD0
NetMXM314-92p2x9p6-0p5-socket_WH_P90: U8.35(RXCLK_PHYADD2) ; port RGMII_RXC
NetMXM314-92p2x9p6-0p5-socket_WH_P91: U8.28(RXD2/MODE2) ; port RGMII_RD2
NetMXM314-92p2x9p6-0p5-socket_WH_P92: U8.22(TXD3) ; port RGMII_TD3
NetR58_1: R58.1 U8.48(ISET)

Not connected (* = marked no-connect by the designer): U8 43(LDO_O)

### Layout directives
differential pair: RGMII_A_N, RGMII_A_P, RGMII_B_N, RGMII_B_P, RGMII_C_N, RGMII_C_P, RGMII_D_N, RGMII_D_P

### Notes on the sheet
- Text
- (in symbol CAPACITOR POL) +
- (in symbol HR911130C_0) 1CT:1CT; P9; Green; P8; P6; P5; P7; P4; P3; P2; 4x75 OHM; Yellow; P1; EARTH_GND; 2KV; 1000pF; P10(DGND)

### Library data of the parts
C38-C41 C43 C44 C48 C51-C53 C97-C108 C110 C111 C113-C119 C209 = CAP_NP: CLASS: DISCRETE
C49 = CAPACITOR POL
D13 = DIODE SCHOTTKY
L3 = INDUCTOR
L12 L13 = BEAD
R47 R49 R50 R55 R57-R60 R121 R123-R125 = RES: CLASS: DISCRETE
TP1 = TP
Y2 = XTAL_13Y_A: CLASS: IC

## Sheet HDMI.SchDoc
size A3
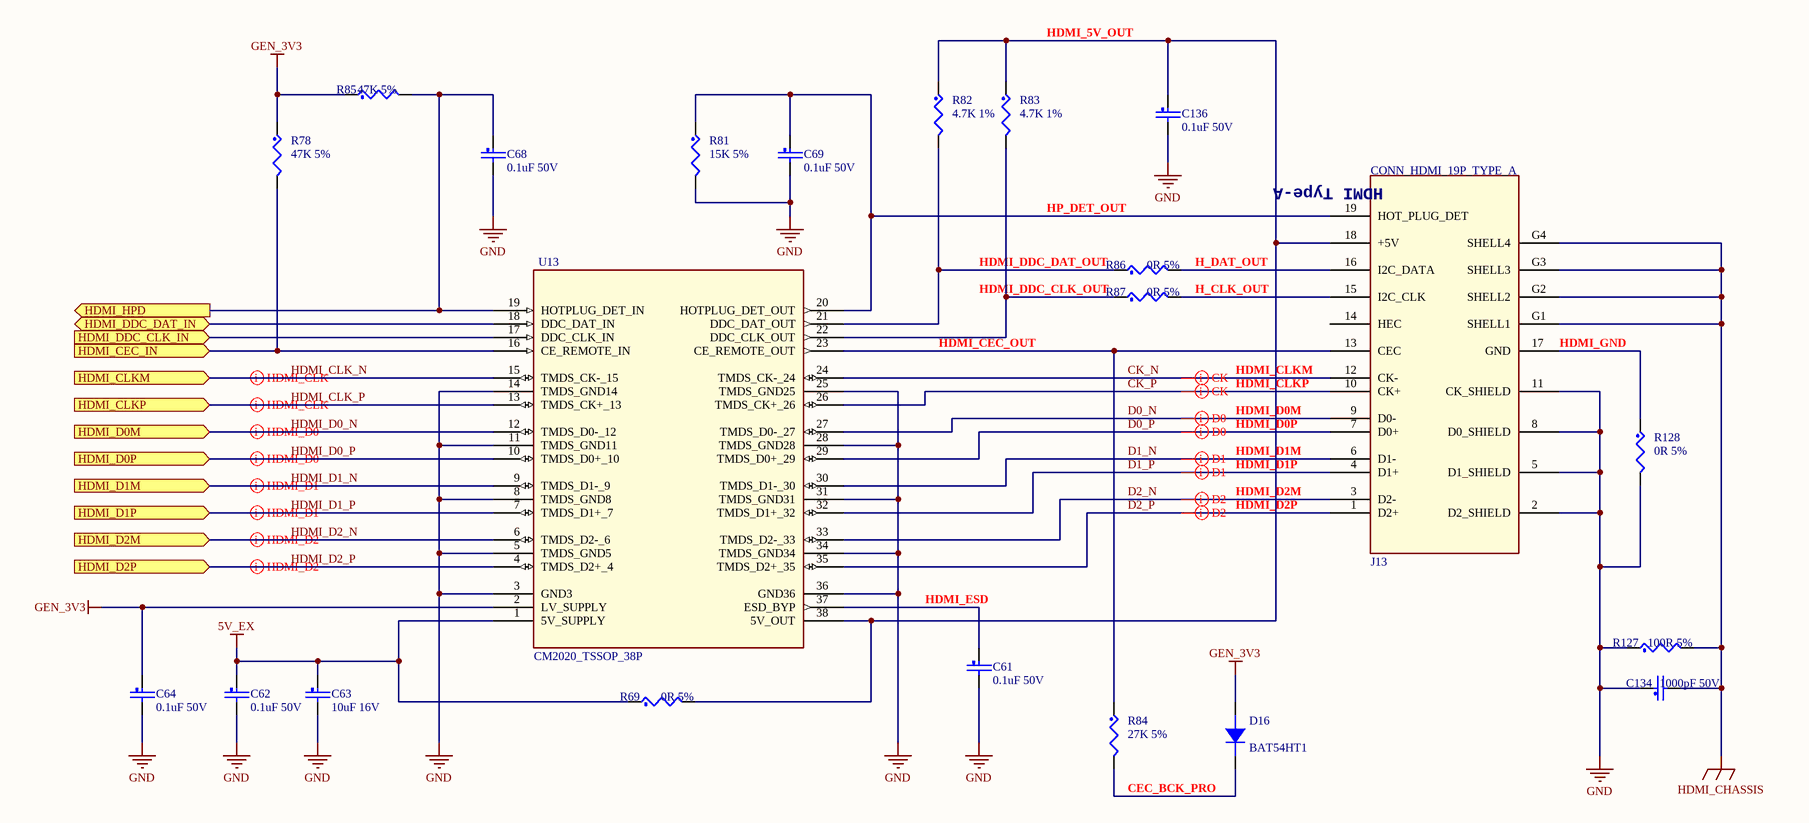
[diagram p5: HDMI.SchDoc]

### Parts
C61  0.1uF 50V  [SC0603]
C62  0.1uF 50V  [SC0603]
C63  10uF 16V  [SC0805]
C64  0.1uF 50V  [SC0603]
C68  0.1uF 50V  [SC0603]
C69  0.1uF 50V  [SC0603]
C134  1000pF 50V  [SC0603]
C136  0.1uF 50V  [SC0603]
D16  BAT54HT1  [SOD323]
J13  CONN_HDMI_19P_TYPE_A  [HDMI-A-LIANSHENG]
R69  0R 5%  [SR0603]
R78  47K 5%  [SR0603]
R81  15K 5%  [SR0603]
R82  4.7K 1%  [SR0603]
R83  4.7K 1%  [SR0603]
R84  27K 5%  [SR0603]
R85  47K 5%  [SR0603]
R86  0R 5%  [SR0603]
R87  0R 5%  [SR0603]
R127  100R 5%  [SR0603]
R128  0R 5%  [SR0603]
U13  CM2020_TSSOP_38P  [TSSOP38-0P5-9P8X4P5]

### Ports
HDMI_CEC_IN (in), HDMI_CLKM (in), HDMI_CLKP (in), HDMI_D0M (in), HDMI_D0P (in), HDMI_D1M (in), HDMI_D1P (in), HDMI_D2M (in), HDMI_D2P (in), HDMI_DDC_CLK_IN (in), HDMI_DDC_DAT_IN (bidir), HDMI_HPD (out)

### Nets
5V_EX: C62.1 C63.1 R69.1 U13.1(5V_SUPPLY)
GEN_3V3: C64.1 D16.1 R78.1 R85.1 U13.2(LV_SUPPLY)
GND: C61.2 C62.2 C63.2 C64.2 C68.2 C69.2 C134.1 C136.2 J13.2(D2_SHIELD) J13.5(D1_SHIELD) J13.8(D0_SHIELD) J13.11(CK_SHIELD) R81.2 R127.1 R128.2 U13.3(GND3) U13.5(TMDS_GND5) U13.8(TMDS_GND8) U13.11(TMDS_GND11) U13.14(TMDS_GND14) U13.25(TMDS_GND25) U13.28(TMDS_GND28) U13.31(TMDS_GND31) U13.34(TMDS_GND34) U13.36(GND36)
HDMI_CHASSIS: C134.2 J13.G1(SHELL1) J13.G2(SHELL2) J13.G3(SHELL3) J13.G4(SHELL4) R127.2
CK_N: J13.12(CK-) U13.24(TMDS_CK-_24)
CK_P: J13.10(CK+) U13.26(TMDS_CK+_26)
D0_N: J13.9(D0-) U13.27(TMDS_D0-_27)
D0_P: J13.7(D0+) U13.29(TMDS_D0+_29)
D1_N: J13.6(D1-) U13.30(TMDS_D1-_30)
D1_P: J13.4(D1+) U13.32(TMDS_D1+_32)
D2_N: J13.3(D2-) U13.33(TMDS_D2-_33)
D2_P: J13.1(D2+) U13.35(TMDS_D2+_35)
HDMI_CLK_N: U13.15(TMDS_CK-_15) ; port HDMI_CLKM
HDMI_CLK_P: U13.13(TMDS_CK+_13) ; port HDMI_CLKP
HDMI_D0_N: U13.12(TMDS_D0-_12) ; port HDMI_D0M
HDMI_D0_P: U13.10(TMDS_D0+_10) ; port HDMI_D0P
HDMI_D1_N: U13.9(TMDS_D1-_9) ; port HDMI_D1M
HDMI_D1_P: U13.7(TMDS_D1+_7) ; port HDMI_D1P
HDMI_D2_N: U13.6(TMDS_D2-_6) ; port HDMI_D2M
HDMI_D2_P: U13.4(TMDS_D2+_4) ; port HDMI_D2P
NetC61_1: C61.1 U13.37(ESD_BYP)
NetC68_1: C68.1 R85.2 U13.19(HOTPLUG_DET_IN) ; port HDMI_HPD
NetC69_1: C69.1 J13.19(HOT_PLUG_DET) R81.1 U13.20(HOTPLUG_DET_OUT)
NetC136_1: C136.1 J13.18(+5V) R69.2 R82.1 R83.1 U13.38(5V_OUT)
NetD16_2: D16.2 R84.2
NetJ13_13: J13.13(CEC) R84.1 U13.23(CE_REMOTE_OUT)
NetJ13_15: J13.15(I2C_CLK) R87.2
NetJ13_16: J13.16(I2C_DATA) R86.2
NetJ13_17: J13.17(GND) R128.1
NetMXM314-92p2x9p6-0p5-socket_WH_S147: R78.2 U13.16(CE_REMOTE_IN) ; port HDMI_CEC_IN
NetR79_2: U13.17(DDC_CLK_IN) ; port HDMI_DDC_CLK_IN
NetR80_2: U13.18(DDC_DAT_IN) ; port HDMI_DDC_DAT_IN
NetR82_2: R82.2 R86.1 U13.21(DDC_DAT_OUT)
NetR83_2: R83.2 R87.1 U13.22(DDC_CLK_OUT)

Not connected (* = marked no-connect by the designer): J13 14(HEC)

### Layout directives
differential pair: CK_N, CK_P, D0_N, D0_P, D1_N, D1_P, D2_N, D2_P, HDMI_CLK_N, HDMI_CLK_P, HDMI_D0_N, HDMI_D0_P, HDMI_D1_N, HDMI_D1_P, HDMI_D2_N, HDMI_D2_P

### Notes on the sheet
- HDMI_5V_OUT
- HP_DET_OUT
- HDMI_DDC_DAT_OUT
- H_DAT_OUT
- HDMI_CEC_OUT
- HDMI_DDC_CLK_OUT
- H_CLK_OUT
- (near J13) HDMI_GND
- HDMI_CLKM
- HDMI_CLKP
- HDMI_D0M
- HDMI_D0P
- HDMI_D1M
- HDMI_D1P
- HDMI_D2M
- HDMI_D2P
- HDMI_ESD
- CEC_BCK_PRO
- (in symbol CONN_HDMI_19P_TYPE_A) HDMI Type-A

### Library data of the parts
C61-C64 C68 C69 C134 C136 = CAP_NP: CLASS: DISCRETE
D16 = DIODE_0
R69 R78 R81-R87 R127 R128 = RES: CLASS: DISCRETE
U13 = CM2020_TSSOP_38P: CLASS: IC

## Sheet I2C.SchDoc
size A4
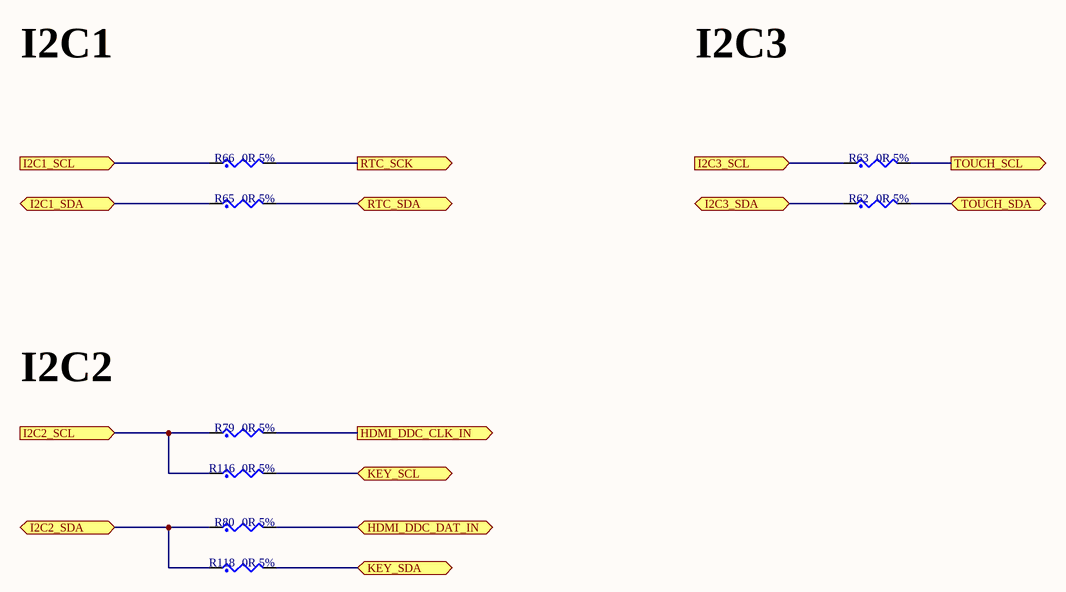
[diagram p6: I2C.SchDoc]

### Parts
R62  0R 5%  [SR0603]
R63  0R 5%  [SR0603]
R65  0R 5%  [SR0603]
R66  0R 5%  [SR0603]
R79  0R 5%  [SR0603]
R80  0R 5%  [SR0603]
R116  0R 5%  [SR0603]
R118  0R 5%  [SR0603]

### Ports
HDMI_DDC_CLK_IN (out), HDMI_DDC_DAT_IN (bidir), I2C1_SCL (in), I2C1_SDA (bidir), I2C2_SCL (in), I2C2_SDA (bidir), I2C3_SCL (in), I2C3_SDA (bidir), KEY_SCL (bidir), KEY_SDA (bidir), RTC_SCK (out), RTC_SDA (bidir), TOUCH_SCL (out), TOUCH_SDA (bidir)

### Nets
NetJ11_21: R63.2 ; port TOUCH_SCL
NetJ11_22: R62.2 ; port TOUCH_SDA
NetMXM314-92p2x9p6-0p5-socket_WH_P141: R65.1 ; port I2C1_SDA
NetMXM314-92p2x9p6-0p5-socket_WH_P142: R66.1 ; port I2C1_SCL
NetMXM314-92p2x9p6-0p5-socket_WH_S20: R80.1 R118.1 ; port I2C2_SDA
NetMXM314-92p2x9p6-0p5-socket_WH_S21: R79.1 R116.1 ; port I2C2_SCL
NetMXM314-92p2x9p6-0p5-socket_WH_S23: R62.1 ; port I2C3_SDA
NetMXM314-92p2x9p6-0p5-socket_WH_S24: R63.1 ; port I2C3_SCL
NetR65_2: R65.2 ; port RTC_SDA
NetR66_2: R66.2 ; port RTC_SCK
NetR79_2: R79.2 ; port HDMI_DDC_CLK_IN
NetR80_2: R80.2 ; port HDMI_DDC_DAT_IN
NetR116_2: R116.2 ; port KEY_SCL
NetR118_2: R118.2 ; port KEY_SDA

### Notes on the sheet
- I2C1
- I2C3
- I2C2

### Library data of the parts
R62 R63 R65 R66 R79 R80 R116 R118 = RES: CLASS: DISCRETE

## Sheet Key-RTC.SchDoc
size A3
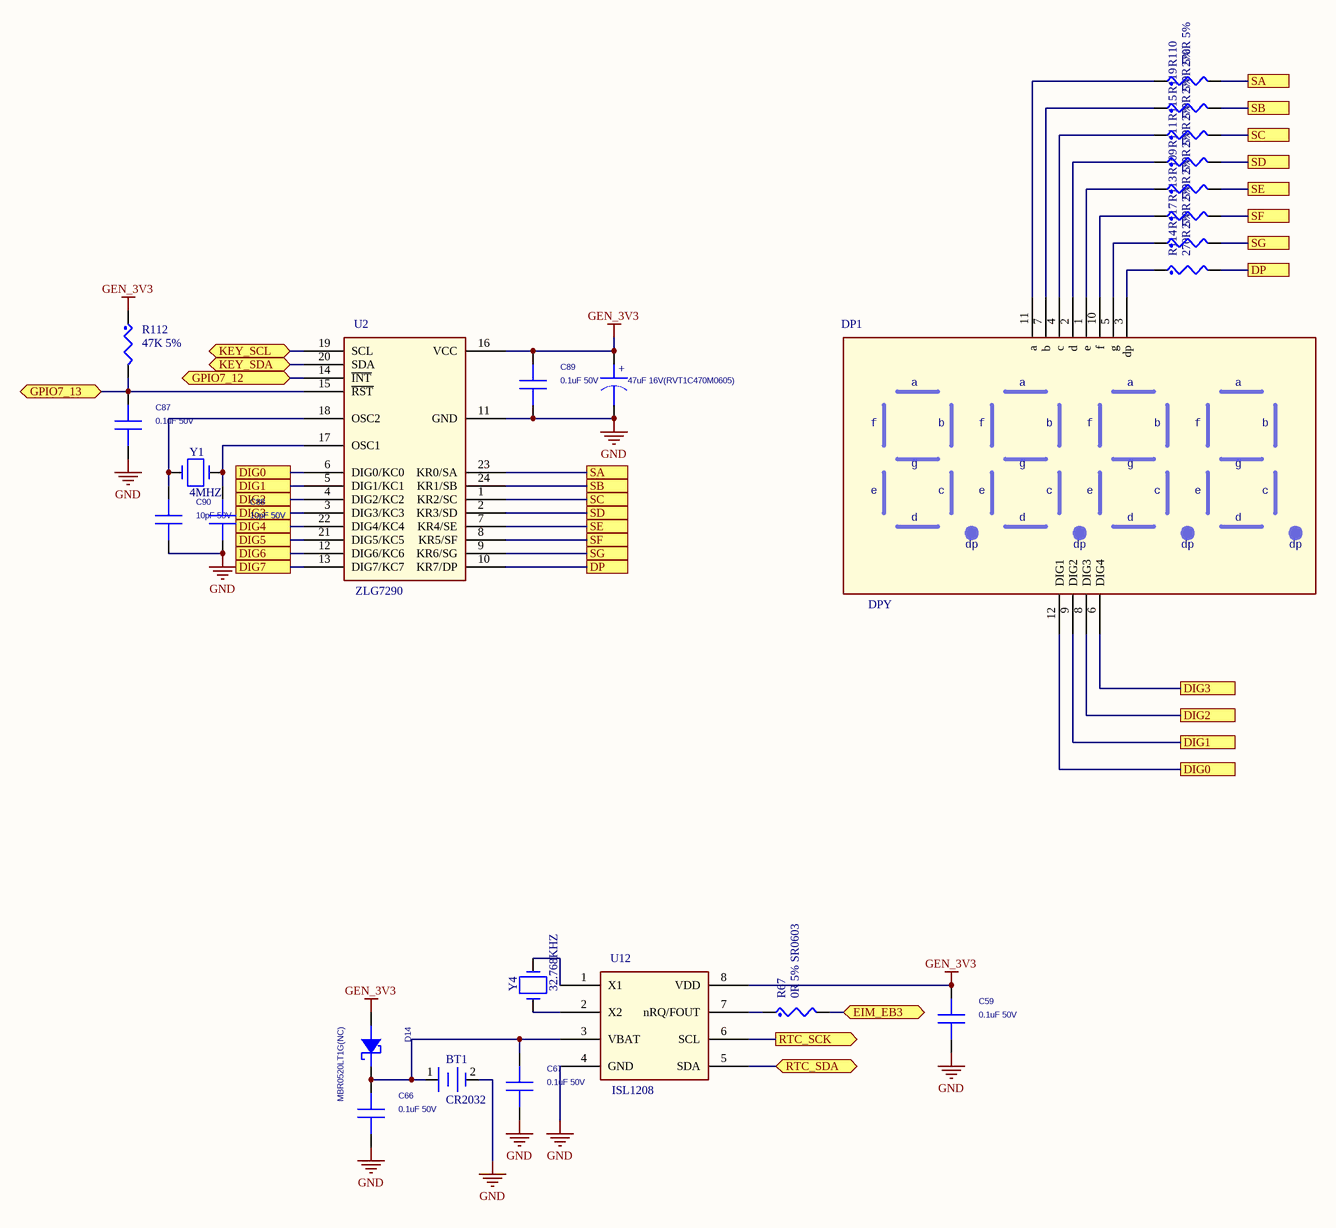
[diagram p7: Key-RTC.SchDoc]

### Parts
BT1  CR2032  [CR2032]
C11  47uF 16V(RVT1C470M0605)  [SCA6P3X5P4]
C59  0.1uF 50V  [SC0603]
C66  0.1uF 50V  [SC0603]
C67  0.1uF 50V  [SC0603]
C87  0.1uF 50V  [SC0603]
C88  10pF 50V  [SC0603]
C89  0.1uF 50V  [SC0603]
C90  10pF 50V  [SC0603]
D14  MBR0520LT1G(NC)  [SOD123]
DP1  DPY  [LEDTUBE-14X30]
R67  0R 5% SR0603  [SR0603]
R109  270R 5%  [SR0603]
R110  270R 5%  [SR0603]
R111  270R 5%  [SR0603]
R112  47K 5%  [SR0603]
R113  270R 5%  [SR0603]
R114  270R 5%  [SR0603]
R115  270R 5%  [SR0603]
R117  270R 5%  [SR0603]
R119  270R 5%  [SR0603]
U2  ZLG7290  [SOP24-1P27-15X10P5]
U12  ISL1208  [SOP8-1p27-5x4]
Y1  4MHZ  [XTAL-2-5P08]
Y4  32.768KHZ  [SCRY2-3X1P5]

### Ports
DIG0, DIG1, DIG2, DIG3, DIG4, DIG5, DIG6, DIG7, DP, EIM_EB3 (bidir), GPIO7_12 (bidir), GPIO7_13 (bidir), KEY_SCL (bidir), KEY_SDA (bidir), RTC_SCK (out), RTC_SDA (bidir), SA, SB, SC, SD, SE, SF, SG

### Nets
GEN_3V3: C11.1 C59.1 C89.1 D14.1(ANODE) R112.1 U2.16(VCC) U12.8(VDD)
GND: BT1.2 C11.2 C59.2 C66.2 C67.2 C87.2 C88.2 C89.2 C90.2 U2.11(GND) U12.4(GND)
NetBT1_1: BT1.1 C66.1 C67.1 D14.2(CATHODE) U12.3(VBAT)
NetC87_1: C87.1 R112.2 U2.15(~{RST}) ; port GPIO7_13
NetC88_1: C88.1 U2.17(OSC1) Y1.2
NetC90_1: C90.1 U2.18(OSC2) Y1.1
NetDP1_1: DP1.1(e) R109.1
NetDP1_2: DP1.2(d) R111.1
NetDP1_3: DP1.3(dp) R114.1
NetDP1_4: DP1.4(c) R115.1
NetDP1_5: DP1.5(g) R117.1
NetDP1_6: DP1.6(DIG4) U2.3(DIG3/KC3) ; port DIG3
NetDP1_7: DP1.7(b) R119.1
NetDP1_8: DP1.8(DIG3) U2.4(DIG2/KC2) ; port DIG2
NetDP1_9: DP1.9(DIG2) U2.5(DIG1/KC1) ; port DIG1
NetDP1_10: DP1.10(f) R113.1
NetDP1_11: DP1.11(a) R110.1
NetDP1_12: DP1.12(DIG1) U2.6(DIG0/KC0) ; port DIG0
NetMXM314-92p2x9p6-0p5-socket_WH_P145: U2.14(~{INT}) ; port GPIO7_12
NetMXM314-92p2x9p6-0p5-socket_WH_S75: R67.2 ; port EIM_EB3
NetR65_2: U12.5(SDA) ; port RTC_SDA
NetR66_2: U12.6(SCL) ; port RTC_SCK
NetR67_1: R67.1 U12.7(nRQ/FOUT)
NetR109_2: R109.2 U2.7(KR4/SE) ; port SE
NetR110_2: R110.2 U2.23(KR0/SA) ; port SA
NetR111_2: R111.2 U2.2(KR3/SD) ; port SD
NetR113_2: R113.2 U2.8(KR5/SF) ; port SF
NetR114_2: R114.2 U2.10(KR7/DP) ; port DP
NetR115_2: R115.2 U2.1(KR2/SC) ; port SC
NetR116_2: U2.19(SCL) ; port KEY_SCL
NetR117_2: R117.2 U2.9(KR6/SG) ; port SG
NetR118_2: U2.20(SDA) ; port KEY_SDA
NetR119_2: R119.2 U2.24(KR1/SB) ; port SB
NetU2_12: U2.12(DIG6/KC6) ; port DIG6
NetU2_13: U2.13(DIG7/KC7) ; port DIG7
NetU2_21: U2.21(DIG5/KC5) ; port DIG5
NetU2_22: U2.22(DIG4/KC4) ; port DIG4
NetU12_1: U12.1(X1) Y4.2
NetU12_2: U12.2(X2) Y4.1

### Notes on the sheet
- (in symbol 100uF-6.3V-20%-AL-LOESR-SMD_5x5) +

### Library data of the parts
BT1 = BATTERY
C11 = 100uF-6.3V-20%-AL-LOESR-SMD_5x5: SCA6p3x5p4; Mfg2_PN: EEE-FPJ101UAR; DNP: No; Cost_1K: 0.071; Cost_100: 0.1324; Dist1: United Chemi-Con; Dist1_PN: EMZA6R3ADA101ME61G; Dielectric: Aluminum; Tolerance: 20%; Device: CAPE_RAD_5_SMT; Mfg2: Panasonic; Cost: 0.188; Mfg1_PN: EMZA6R3ADA101ME61G; Mfg1: United Chemi-Con
C59 C66 C67 C87-C90 = 0.1uF-6.3V-10%-X5R-0402: Capacitor, 0.1uF, 50V, 10%, X5R, 0603; Cost_100: 0.0184; Cost_1K: 0.01005; Dist1: Digikey; Dist1_PN: PCC2146CT-ND; Device: CAP0402; Mfg1_PN: ECJ-0EB1A104K; Mfg1: Panasonic; Voltage: 6.3V; Cost_Reel: 0.00871; Mfg2_PN: MCCJ104K0NRTF; DNP: No; Cost: 0.026; Dielectric: X5R; TOLERANCE: 10%; Mfg2: SMEC
D14 = DIODE SCHOTTKY_Dup1: SOD123
R67 = RES: CLASS: DISCRETE
R109-R115 R117 R119 = RES: SR0603; CLASS: DISCRETE
U2 = ZLG7290: SOP24-1p27-15x10p5
U12 = ISL1208: SL1208  SOP8-1p27-5x4
Y1 = CRYSTAL_0: XTAL-2-5p08
Y4 = CRYSTAL_0: SCRY2-3x1p5

## Sheet LVDS.SchDoc
size A4
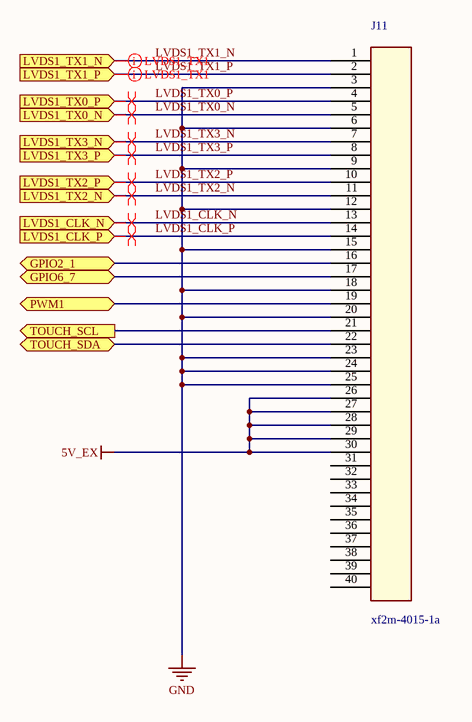
[diagram p8: LVDS.SchDoc]

### Parts
J11  xf2m-4015-1a  [FPC40-0P5-OMRON]

### Ports
GPIO2_1 (bidir), GPIO6_7 (bidir), LVDS1_CLK_N (in), LVDS1_CLK_P (in), LVDS1_TX0_N (in), LVDS1_TX0_P (in), LVDS1_TX1_N (in), LVDS1_TX1_P (in), LVDS1_TX2_N (in), LVDS1_TX2_P (in), LVDS1_TX3_N (in), LVDS1_TX3_P (in), PWM1 (bidir), TOUCH_SCL (out), TOUCH_SDA (bidir)

### Nets
5V_EX: J11.26 J11.27 J11.28 J11.29 J11.30
GND: J11.3 J11.6 J11.9 J11.12 J11.15 J11.18 J11.20 J11.23 J11.24 J11.25
LVDS1_CLK_N: J11.13 ; port LVDS1_CLK_N
LVDS1_CLK_P: J11.14 ; port LVDS1_CLK_P
LVDS1_TX0_N: J11.5 ; port LVDS1_TX0_N
LVDS1_TX0_P: J11.4 ; port LVDS1_TX0_P
LVDS1_TX1_N: J11.1 ; port LVDS1_TX1_N
LVDS1_TX1_P: J11.2 ; port LVDS1_TX1_P
LVDS1_TX2_N: J11.11 ; port LVDS1_TX2_N
LVDS1_TX2_P: J11.10 ; port LVDS1_TX2_P
LVDS1_TX3_N: J11.7 ; port LVDS1_TX3_N
LVDS1_TX3_P: J11.8 ; port LVDS1_TX3_P
NetJ11_16: J11.16 ; port GPIO2_1
NetJ11_17: J11.17 ; port GPIO6_7
NetJ11_19: J11.19 ; port PWM1
NetJ11_21: J11.21 ; port TOUCH_SCL
NetJ11_22: J11.22 ; port TOUCH_SDA

Not connected (* = marked no-connect by the designer): J11 31 32 33 34 35 36 37 38 39 40

### Layout directives
differential pair: LVDS1_CLK_N, LVDS1_CLK_P, LVDS1_TX0_N, LVDS1_TX0_P, LVDS1_TX1_N, LVDS1_TX1_P, LVDS1_TX2_N, LVDS1_TX2_P, LVDS1_TX3_N, LVDS1_TX3_P

### Library data of the parts
J11 = CON40